# Altium project EDU_High-Speed-Design.PrjPcb (part 1 of 5)
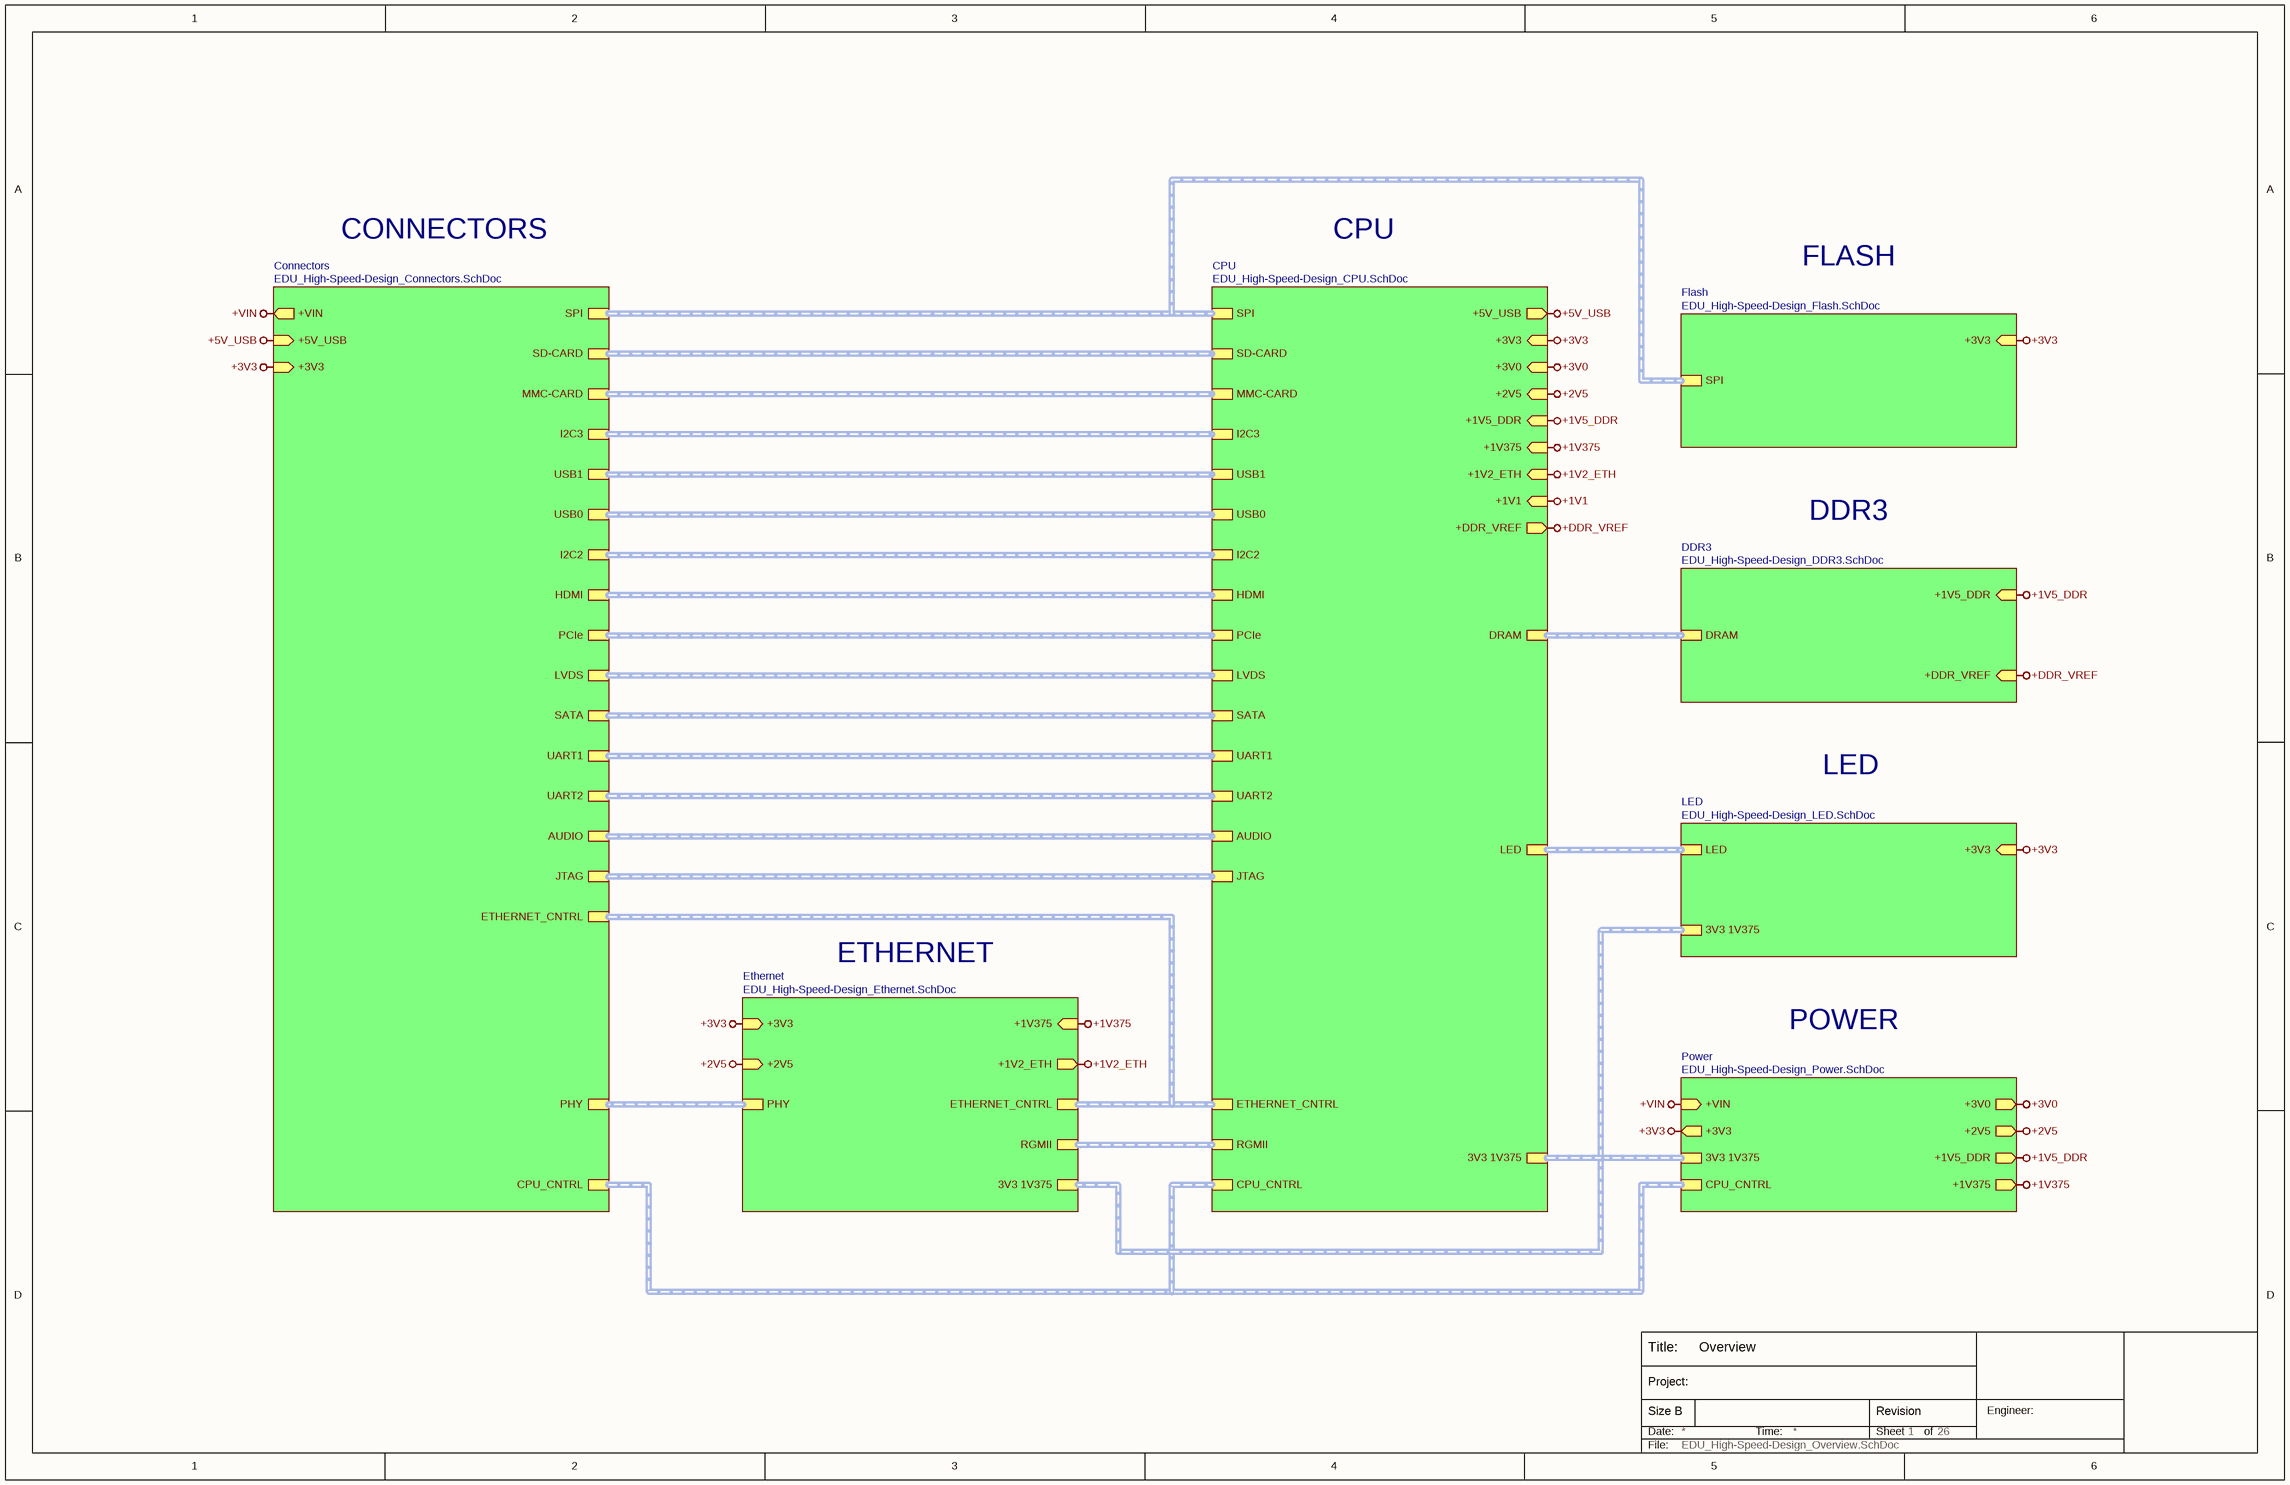
[diagram p0: EDU_High-Speed-Design_Overview.SchDoc]
GlobalAsmDwgTitle: Assembly Drawing; GlobalDocumentTitle: EDU High-Speed Design; GlobalEngineer: Podlesnyi Vasilii; GlobalPcbDwgTitle: PCB Drawing; GlobalProjectTitle: EDU High-Speed Design; GlobalRevisionBOM: 0.1; GlobalRevisionPCB: 0.1; GlobalRevisionSCH: 0.1
26 sheets, 457 parts. Net scope: hierarchical (ports join the sheet entries above them; power ports are global).
Board file: EDU_High-Speed-Design.PcbDoc
Sheets:
  EDU_High-Speed-Design_Overview.SchDoc
    CPU = EDU_High-Speed-Design_CPU.SchDoc
      CPU Unused = EDU_High-Speed-Design_CPU_Unused.SchDoc
      CPU Power = EDU_High-Speed-Design_CPU_Power.SchDoc
      CPU Control = EDU_High-Speed-Design_CPU_Control.SchDoc
      CPU Uart = EDU_High-Speed-Design_CPU_Uart.SchDoc
      CPU Audio = EDU_High-Speed-Design_CPU_Audio.SchDoc
      CPU Ethernet = EDU_High-Speed-Design_CPU_Ethernet.SchDoc
      CPU USB = EDU_High-Speed-Design_CPU_USB.SchDoc
      CPU LVDS = EDU_High-Speed-Design_CPU_LVDS.SchDoc
      CPU HDMI = EDU_High-Speed-Design_CPU_HDMI.SchDoc
      CPU PCIe = EDU_High-Speed-Design_CPU_PCIe.SchDoc
      CPU DDR3 = EDU_High-Speed-Design_CPU_DDR3.SchDoc
      CPU SD-Card = EDU_High-Speed-Design_CPU_SD-Card.SchDoc
      CPU MMC-Card = EDU_High-Speed-Design_CPU_MMC-Card.SchDoc
      CPU SPI I2C = EDU_High-Speed-Design_CPU_SPI_I2C.SchDoc
      CPU SATA = EDU_High-Speed-Design_CPU_SATA.SchDoc
    Connectors = EDU_High-Speed-Design_Connectors.SchDoc
    Ethernet = EDU_High-Speed-Design_Ethernet.SchDoc
    Flash = EDU_High-Speed-Design_Flash.SchDoc
    DDR3 = EDU_High-Speed-Design_DDR3.SchDoc
    Power = EDU_High-Speed-Design_Power.SchDoc
      3V3 1V375 = EDU_High-Speed-Design_Power_3V3_1V375.SchDoc
      3V0 = EDU_High-Speed-Design_Power_3V0.SchDoc
      2V5 1V5 = EDU_High-Speed-Design_Power_2V5_1V5.SchDoc
    LED = EDU_High-Speed-Design_LED.SchDoc

## Sheet EDU_High-Speed-Design_Overview.SchDoc: Overview
size 431 x 279 mm; Date: not used; ApprovedBy: not used; CheckedBy: not used; Author: not used; DrawnBy: not used; Engineer: Podlesnyi Vasilii; Organization: not used; Address4: not used; Revision: 0.1; SheetNumber: 1; SheetTotal: 26; ProjectTitle: EDU High-Speed Design; Time: not used; ImagePath: not used; Application_BuildNumber: not used

### Sub-sheets
Connectors = EDU_High-Speed-Design_Connectors.SchDoc: +VIN (out), +5V_USB (in), +3V3 (in), JTAG (harness JTAG), CPU_CNTRL (harness CPU_CNTRL), AUDIO (harness AUDIO), UART2 (harness UART2), UART1 (harness UART1), SATA (harness SATA), LVDS (harness LVDS), PCIe (harness PCIe), HDMI (harness HDMI), I2C2 (harness I2C2), USB0 (harness USB0), USB1 (harness USB1), SPI (harness SPI), I2C3 (harness I2C3), MMC-CARD (harness MMC-CARD), SD-CARD (harness SD-CARD), PHY (harness PHY), ETHERNET_CNTRL (harness ETHERNET_CNTRL)
CPU = EDU_High-Speed-Design_CPU.SchDoc: +3V3 (in), +3V0 (in), +2V5 (in), +1V375 (in), +1V2_ETH (in), RGMII (harness RGMII), JTAG (harness JTAG), CPU_CNTRL (harness CPU_CNTRL), UART1 (harness UART1), UART2 (harness UART2), AUDIO (harness AUDIO), ETHERNET_CNTRL (harness ETHERNET_CNTRL), USB1 (harness USB1), USB0 (harness USB0), LVDS (harness LVDS), I2C3 (harness I2C3), HDMI (harness HDMI), I2C2 (harness I2C2), SATA (harness SATA), PCIe (harness PCIe), DRAM (harness DRAM), MMC-CARD (harness MMC-CARD), SPI (harness SPI), +5V_USB (out), LED (harness LED), +1V1 (in), SD-CARD (harness SD-CARD), +1V5_DDR (in), +DDR_VREF (out), 3V3 1V375 (harness 3V3 1V375)
DDR3 = EDU_High-Speed-Design_DDR3.SchDoc: +1V5_DDR (in), DRAM (harness DRAM), +DDR_VREF (in)
Ethernet = EDU_High-Speed-Design_Ethernet.SchDoc: RGMII (harness RGMII), +3V3 (in), PHY (harness PHY), +2V5 (in), ETHERNET_CNTRL (harness ETHERNET_CNTRL), +1V2_ETH (out), +1V375 (in), 3V3 1V375 (harness 3V3 1V375)
Flash = EDU_High-Speed-Design_Flash.SchDoc: +3V3 (in), SPI (harness SPI)
LED = EDU_High-Speed-Design_LED.SchDoc: +3V3 (in), LED (harness LED), 3V3 1V375 (harness 3V3 1V375)
Power = EDU_High-Speed-Design_Power.SchDoc: +2V5 (out), +VIN (in), +3V3 (out), 3V3 1V375 (harness 3V3 1V375), +3V0 (out), +1V375 (out), +1V5_DDR (out), CPU_CNTRL (harness CPU_CNTRL)

### Nets
+1V2_ETH: sheet CPU/+1V2_ETH, sheet Ethernet/+1V2_ETH
+1V5_DDR: sheet CPU/+1V5_DDR, sheet DDR3/+1V5_DDR, sheet Power/+1V5_DDR
+1V375: sheet CPU/+1V375, sheet Ethernet/+1V375, sheet Power/+1V375
+2V5: sheet CPU/+2V5, sheet Ethernet/+2V5, sheet Power/+2V5
+3V0: sheet CPU/+3V0, sheet Power/+3V0
+3V3: sheet CPU/+3V3, sheet Connectors/+3V3, sheet Ethernet/+3V3, sheet Flash/+3V3, sheet Power/+3V3, sheet LED/+3V3
+5V_USB: sheet CPU/+5V_USB, sheet Connectors/+5V_USB
+DDR_VREF: sheet CPU/+DDR_VREF, sheet DDR3/+DDR_VREF
+VIN: sheet Connectors/+VIN, sheet Power/+VIN

### Buses and harness runs
harness sheet Connectors/AUDIO = sheet CPU/AUDIO
harness sheet Connectors/CPU_CNTRL = sheet CPU/CPU_CNTRL = sheet Power/CPU_CNTRL
harness sheet Connectors/ETHERNET_CNTRL = sheet CPU/ETHERNET_CNTRL = sheet Ethernet/ETHERNET_CNTRL
harness sheet Connectors/HDMI = sheet CPU/HDMI
harness sheet Connectors/I2C2 = sheet CPU/I2C2
harness sheet Connectors/I2C3 = sheet CPU/I2C3
harness sheet Connectors/JTAG = sheet CPU/JTAG
harness sheet Connectors/LVDS = sheet CPU/LVDS
harness sheet Connectors/MMC-CARD = sheet CPU/MMC-CARD
harness sheet Connectors/PCIe = sheet CPU/PCIe
harness sheet Connectors/PHY = sheet Ethernet/PHY
harness sheet Connectors/SATA = sheet CPU/SATA
harness sheet Connectors/SD-CARD = sheet CPU/SD-CARD
harness sheet Connectors/SPI = sheet CPU/SPI = sheet Flash/SPI
harness sheet Connectors/UART1 = sheet CPU/UART1
harness sheet Connectors/UART2 = sheet CPU/UART2
harness sheet Connectors/USB0 = sheet CPU/USB0
harness sheet Connectors/USB1 = sheet CPU/USB1
harness sheet CPU/3V3 1V375 = sheet Ethernet/3V3 1V375 = sheet LED/3V3 1V375 = sheet Power/3V3 1V375
harness sheet CPU/DRAM = sheet DDR3/DRAM
harness sheet CPU/LED = sheet LED/LED
harness sheet CPU/RGMII = sheet Ethernet/RGMII

### Notes on the sheet
- CONNECTORS
- CPU
- FLASH
- DDR3
- LED
- ETHERNET
- POWER
- Title:
- Date:
- Size B
- Project:
- Time:
- Sheet
- Revision
- of
- Engineer:
- File:

## Sheet EDU_High-Speed-Design_CPU.SchDoc: CPU
size 431 x 279 mm; Date: not used; ApprovedBy: not used; CheckedBy: not used; Author: not used; DrawnBy: not used; Engineer: Podlesnyi Vasilii; Organization: not used; Address4: not used; Revision: 0.1; SheetNumber: 11; SheetTotal: 26; ProjectTitle: EDU High-Speed Design; Time: not used; ImagePath: not used; Application_BuildNumber: not used
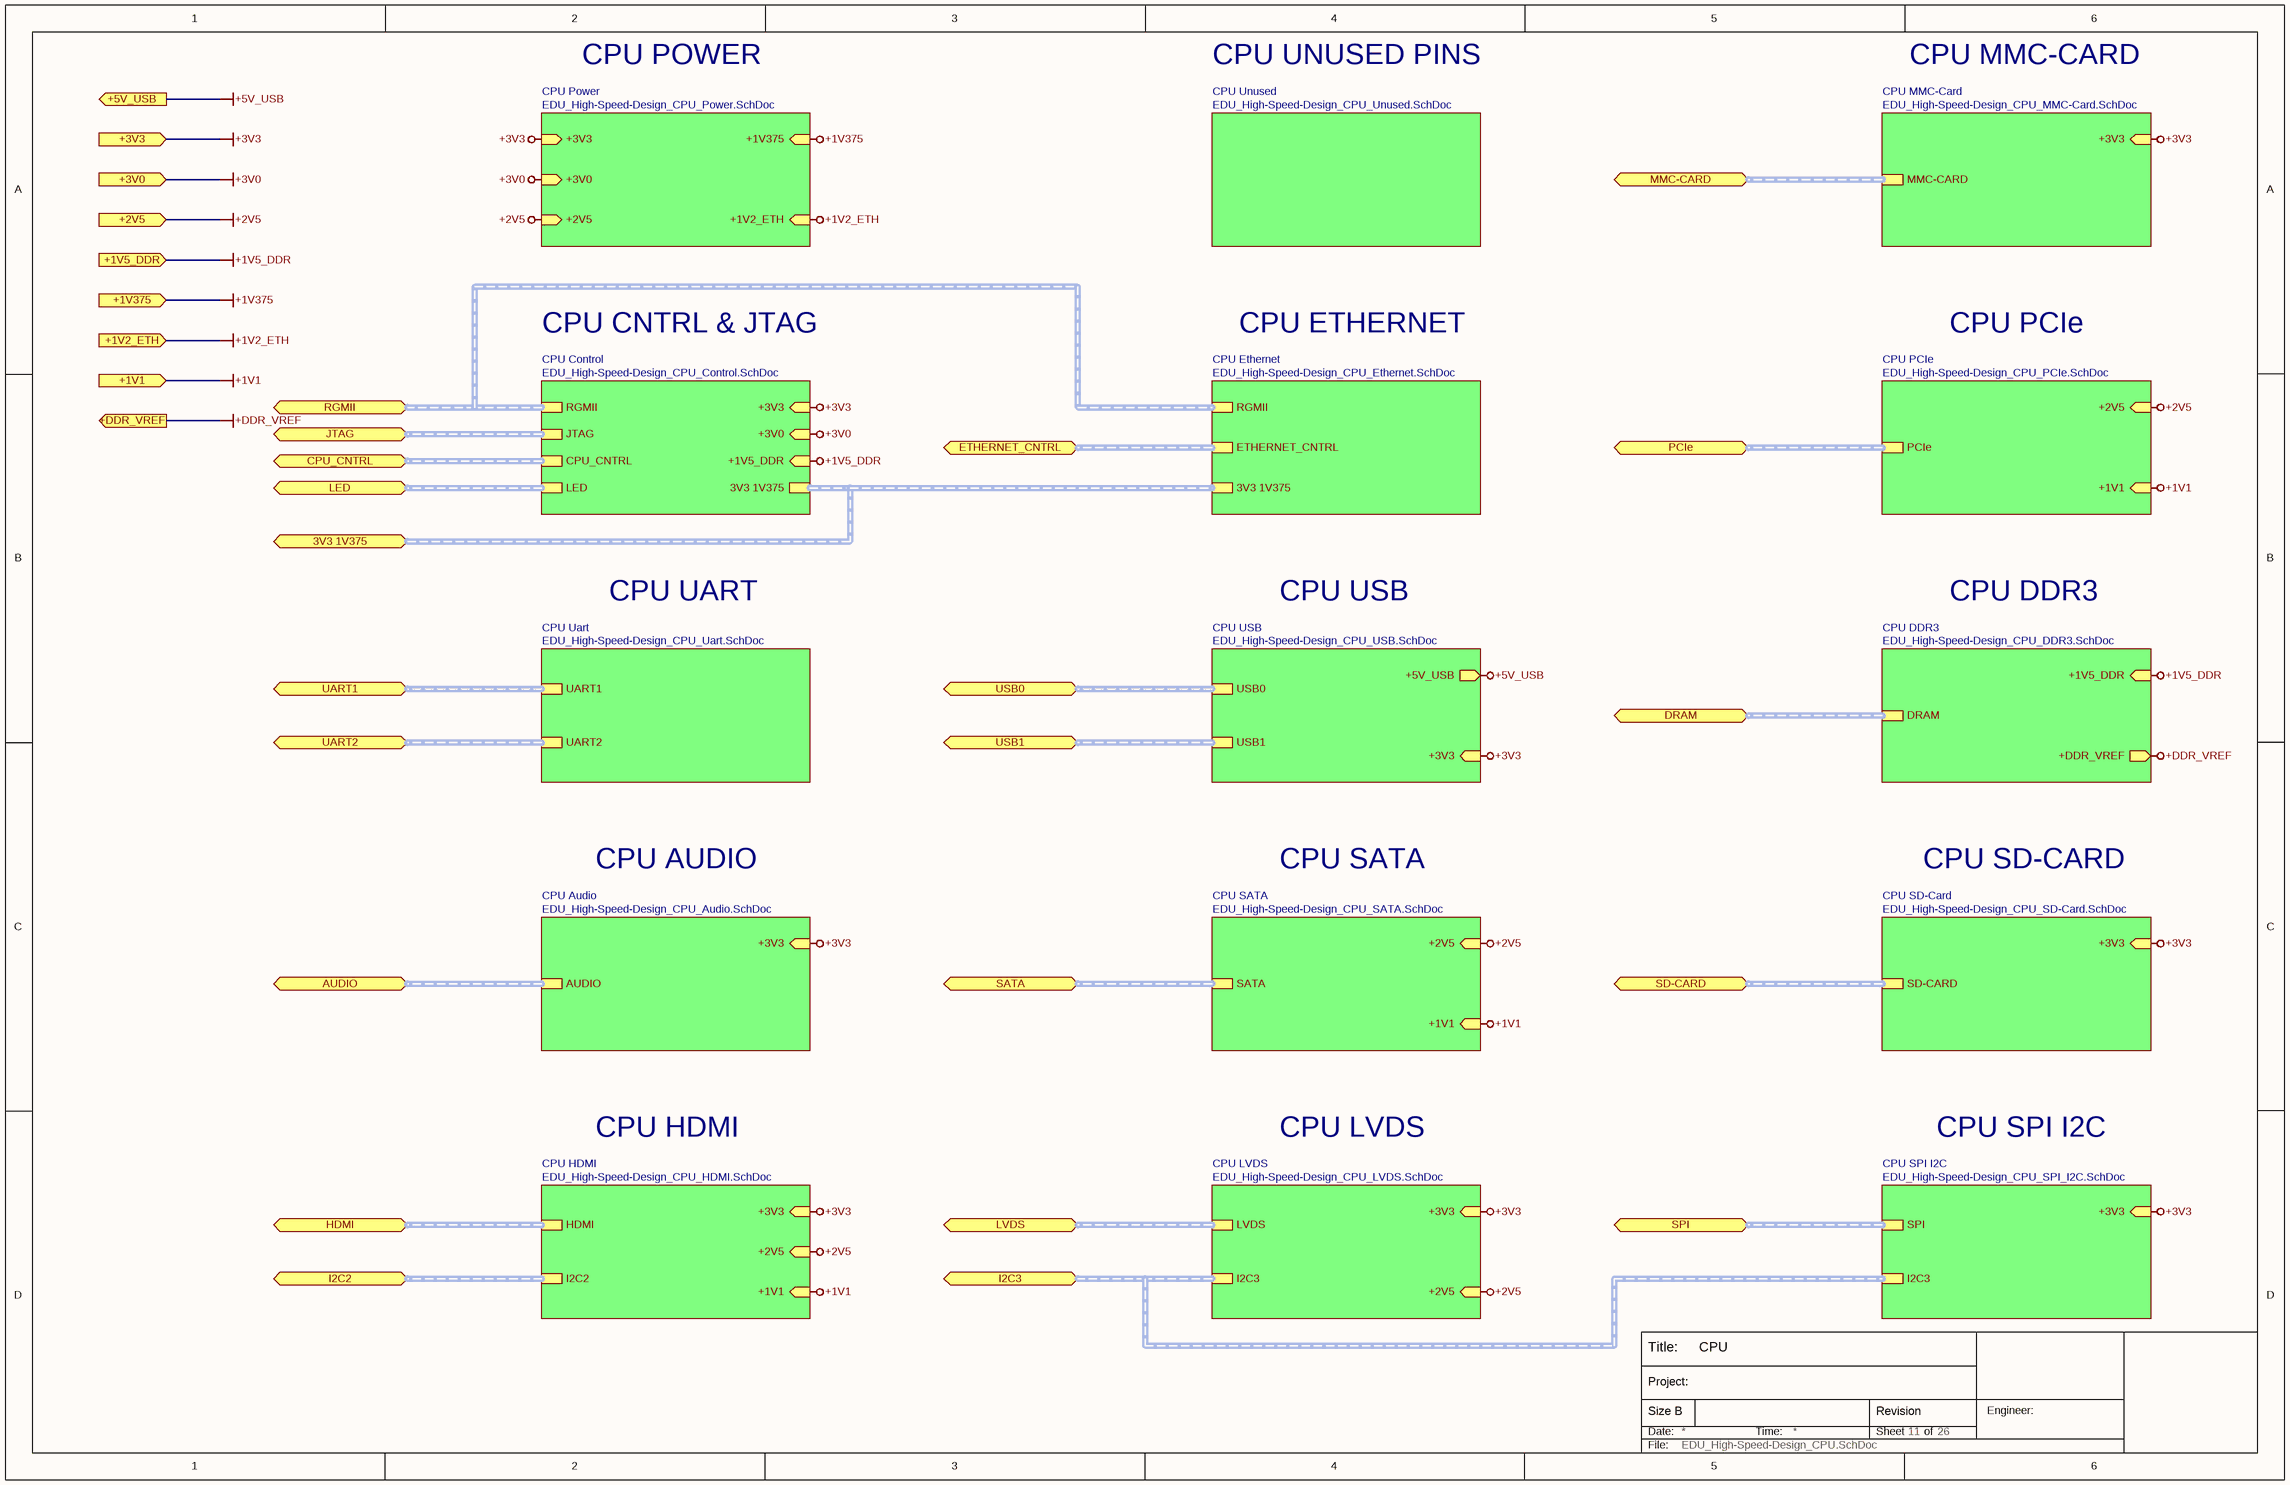
[diagram p1: EDU_High-Speed-Design_CPU.SchDoc]

### Sub-sheets
CPU Audio = EDU_High-Speed-Design_CPU_Audio.SchDoc: AUDIO (harness AUDIO), +3V3 (in)
CPU Control = EDU_High-Speed-Design_CPU_Control.SchDoc: RGMII (harness RGMII), JTAG (harness JTAG), CPU_CNTRL (harness CPU_CNTRL), LED (harness LED), +3V3 (in), +3V0 (in), +1V5_DDR (in), 3V3 1V375 (harness 3V3 1V375)
CPU DDR3 = EDU_High-Speed-Design_CPU_DDR3.SchDoc: DRAM (harness DRAM), +1V5_DDR (in), +DDR_VREF (out)
CPU Ethernet = EDU_High-Speed-Design_CPU_Ethernet.SchDoc: RGMII (harness RGMII), ETHERNET_CNTRL (harness ETHERNET_CNTRL), 3V3 1V375 (harness 3V3 1V375)
CPU HDMI = EDU_High-Speed-Design_CPU_HDMI.SchDoc: HDMI (harness HDMI), +3V3 (in), I2C2 (harness I2C2), +2V5 (in), +1V1 (in)
CPU LVDS = EDU_High-Speed-Design_CPU_LVDS.SchDoc: LVDS (harness LVDS), I2C3 (harness I2C3), +3V3 (in), +2V5 (in)
CPU MMC-Card = EDU_High-Speed-Design_CPU_MMC-Card.SchDoc: MMC-CARD (harness MMC-CARD), +3V3 (in)
CPU PCIe = EDU_High-Speed-Design_CPU_PCIe.SchDoc: PCIe (harness PCIe), +2V5 (in), +1V1 (in)
CPU Power = EDU_High-Speed-Design_CPU_Power.SchDoc: +3V3 (in), +3V0 (in), +2V5 (in), +1V375 (in), +1V2_ETH (in)
CPU SATA = EDU_High-Speed-Design_CPU_SATA.SchDoc: SATA (harness SATA), +2V5 (in), +1V1 (in)
CPU SD-Card = EDU_High-Speed-Design_CPU_SD-Card.SchDoc: SD-CARD (harness SD-CARD), +3V3 (in)
CPU SPI I2C = EDU_High-Speed-Design_CPU_SPI_I2C.SchDoc: SPI (harness SPI), I2C3 (harness I2C3), +3V3 (in)
CPU Uart = EDU_High-Speed-Design_CPU_Uart.SchDoc: UART1 (harness UART1), UART2 (harness UART2)
CPU Unused = EDU_High-Speed-Design_CPU_Unused.SchDoc: no entries
CPU USB = EDU_High-Speed-Design_CPU_USB.SchDoc: USB0 (harness USB0), USB1 (harness USB1), +5V_USB (out), +3V3 (in)

### Ports
3V3 1V375 (bidir, harness 3V3 1V375), +1V1 (in), +1V2_ETH (in), +1V5_DDR (in), +1V375 (in), +2V5 (in), +3V0 (in), +3V3 (in), +5V_USB (out), +DDR_VREF (out), AUDIO (bidir, harness AUDIO), CPU_CNTRL (bidir, harness CPU_CNTRL), DRAM (bidir, harness DRAM), ETHERNET_CNTRL (bidir, harness ETHERNET_CNTRL), HDMI (bidir, harness HDMI), I2C2 (bidir, harness I2C2), I2C3 (bidir, harness I2C3), JTAG (bidir, harness JTAG), LED (bidir, harness LED), LVDS (bidir, harness LVDS), MMC-CARD (bidir, harness MMC-CARD), PCIe (bidir, harness PCIe), RGMII (bidir, harness RGMII), SATA (bidir, harness SATA), SD-CARD (bidir, harness SD-CARD), SPI (bidir, harness SPI), UART1 (bidir, harness UART1), UART2 (bidir, harness UART2), USB0 (bidir, harness USB0), USB1 (bidir, harness USB1)

### Nets
+1V1: port +1V1, sheet CPU HDMI/+1V1, sheet CPU PCIe/+1V1, sheet CPU SATA/+1V1
+1V2_ETH: port +1V2_ETH, sheet CPU Power/+1V2_ETH
+1V5_DDR: port +1V5_DDR, sheet CPU Control/+1V5_DDR, sheet CPU DDR3/+1V5_DDR
+1V375: port +1V375, sheet CPU Power/+1V375
+2V5: port +2V5, sheet CPU Power/+2V5, sheet CPU LVDS/+2V5, sheet CPU HDMI/+2V5, sheet CPU PCIe/+2V5, sheet CPU SATA/+2V5
+3V0: port +3V0, sheet CPU Power/+3V0, sheet CPU Control/+3V0
+3V3: port +3V3, sheet CPU Power/+3V3, sheet CPU Control/+3V3, sheet CPU Audio/+3V3, sheet CPU USB/+3V3, sheet CPU LVDS/+3V3, sheet CPU HDMI/+3V3, sheet CPU SD-Card/+3V3, sheet CPU MMC-Card/+3V3, sheet CPU SPI I2C/+3V3
+5V_USB: port +5V_USB, sheet CPU USB/+5V_USB
+DDR_VREF: port +DDR_VREF, sheet CPU DDR3/+DDR_VREF

### Buses and harness runs
harness port 3V3 1V375 = sheet CPU Control/3V3 1V375 = sheet CPU Ethernet/3V3 1V375
harness port AUDIO = sheet CPU Audio/AUDIO
harness port CPU_CNTRL = sheet CPU Control/CPU_CNTRL
harness port DRAM = sheet CPU DDR3/DRAM
harness port ETHERNET_CNTRL = sheet CPU Ethernet/ETHERNET_CNTRL
harness port HDMI = sheet CPU HDMI/HDMI
harness port I2C2 = sheet CPU HDMI/I2C2
harness port I2C3 = sheet CPU LVDS/I2C3 = sheet CPU SPI I2C/I2C3
harness port JTAG = sheet CPU Control/JTAG
harness port LED = sheet CPU Control/LED
harness port LVDS = sheet CPU LVDS/LVDS
harness port MMC-CARD = sheet CPU MMC-Card/MMC-CARD
harness port PCIe = sheet CPU PCIe/PCIe
harness port RGMII = sheet CPU Control/RGMII = sheet CPU Ethernet/RGMII
harness port SATA = sheet CPU SATA/SATA
harness port SD-CARD = sheet CPU SD-Card/SD-CARD
harness port SPI = sheet CPU SPI I2C/SPI
harness port UART1 = sheet CPU Uart/UART1
harness port UART2 = sheet CPU Uart/UART2
harness port USB0 = sheet CPU USB/USB0
harness port USB1 = sheet CPU USB/USB1

### Notes on the sheet
- CPU POWER
- CPU UNUSED PINS
- CPU MMC-CARD
- CPU CNTRL & JTAG
- CPU ETHERNET
- CPU PCIe
- CPU UART
- CPU USB
- CPU DDR3
- CPU AUDIO
- CPU SATA
- CPU SD-CARD
- CPU HDMI
- CPU LVDS
- CPU SPI I2C
- Title:
- Date:
- Size B
- Project:
- Time:
- Sheet
- Revision
- of
- Engineer:
- File:

## Sheet EDU_High-Speed-Design_CPU_Unused.SchDoc: CPU Unused
size 431 x 279 mm; Date: not used; ApprovedBy: not used; CheckedBy: not used; Author: not used; DrawnBy: not used; Engineer: Podlesnyi Vasilii; Organization: not used; Address4: not used; Revision: 0.1; SheetNumber: 27; SheetTotal: 27; ProjectTitle: EDU High-Speed Design; Time: not used; ImagePath: not used; Application_BuildNumber: not used
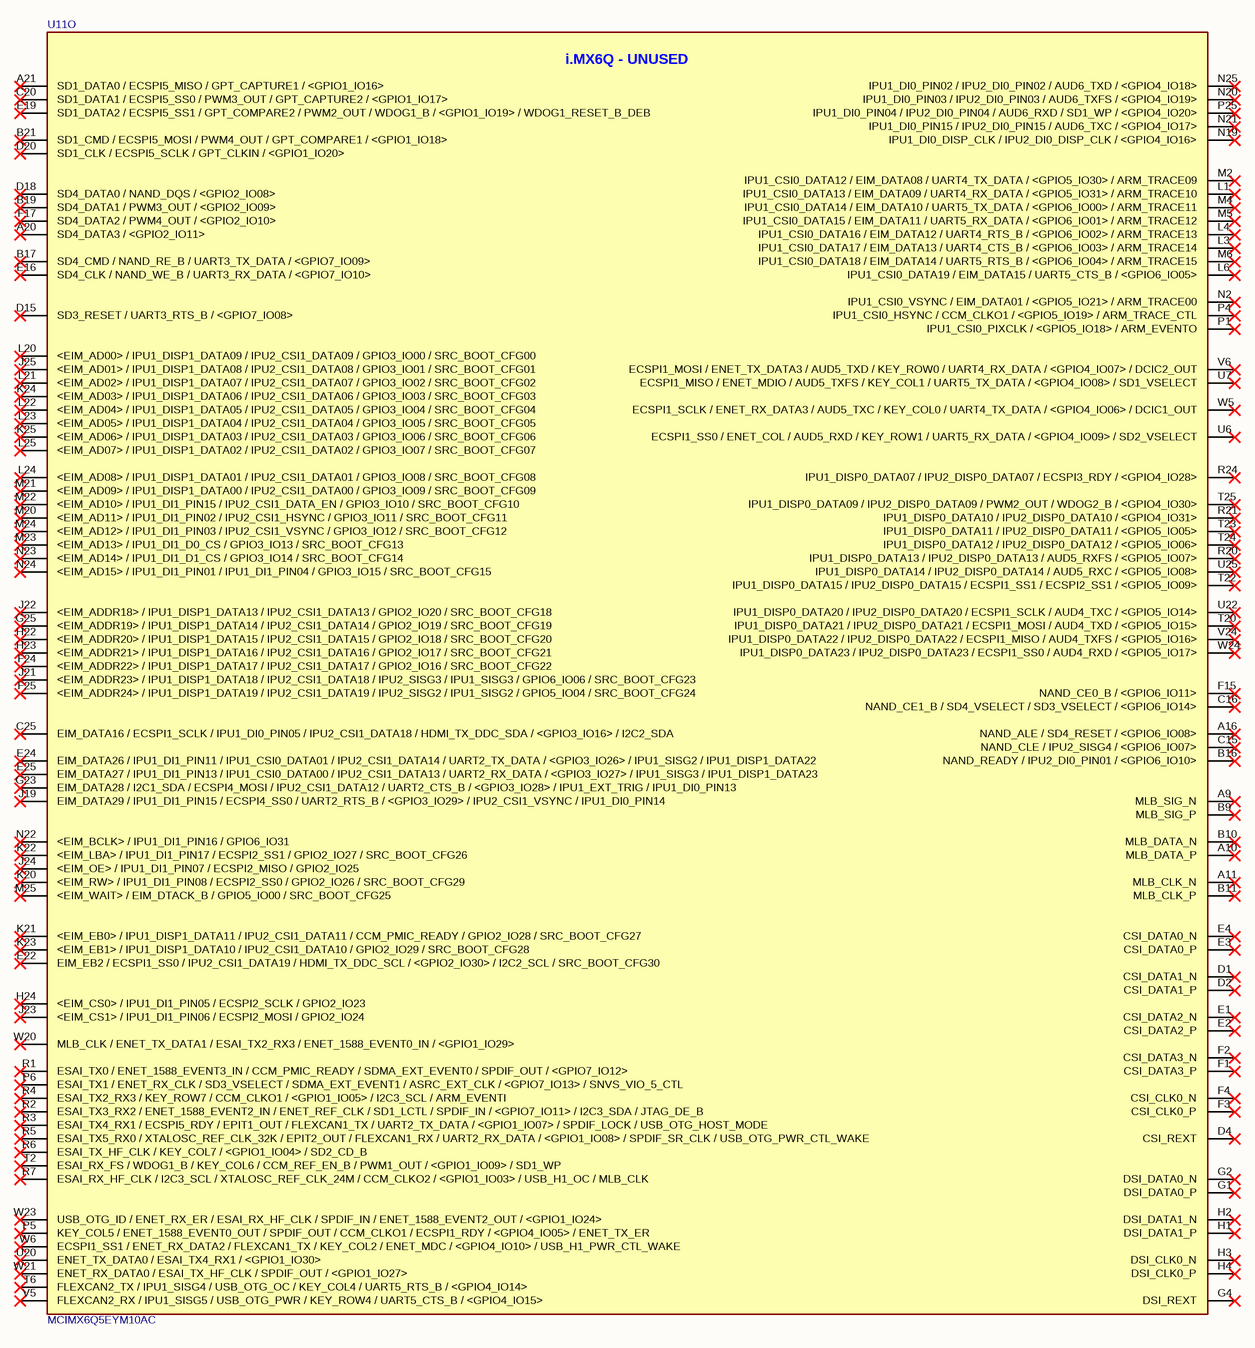
[diagram p2: EDU_High-Speed-Design_CPU_Unused.SchDoc]

### Parts
U11  MCIMX6Q5EYM10AC  [MCIMX6Q5EYM10AC]  (part O of 15)

### Nets

Not connected (* = marked no-connect by the designer): U11 A9(MLB_SIG_N)* A10(MLB_DATA_P)* A11(MLB_CLK_N)* A16(NAND_ALE_/_SD4_RESET_/_<GPIO6_IO08>)* A20(SD4_DATA3_/_<GPIO2_IO11>)* A21(SD1_DATA0_/_ECSPI5_MISO_/_GPT_CAPTURE1_/_<GPIO1_IO16>)* B9(MLB_SIG_P)* B10(MLB_DATA_N)* B11(MLB_CLK_P)* B16(NAND_READY_/_IPU2_DI0_PIN01_/_<GPIO6_IO10>)* B17(SD4_CMD_/_NAND_RE_B_/_UART3_TX_DATA_/_<GPIO7_IO09>)* B19(SD4_DATA1_/_PWM3_OUT_/_<GPIO2_IO09>)* B21(SD1_CMD_/_ECSPI5_MOSI_/_PWM4_OUT_/_GPT_COMPARE1_/_<GPIO1_IO18>)* C15(NAND_CLE_/_IPU2_SISG4_/_<GPIO6_IO07>)* C16(NAND_CE1_B_/_SD4_VSELECT_/_SD3_VSELECT_/_<GPIO6_IO14>)* C20(SD1_DATA1_/_ECSPI5_SS0_/_PWM3_OUT_/_GPT_CAPTURE2_/_<GPIO1_IO17>)* C25(EIM_DATA16_/_ECSPI1_SCLK_/_IPU1_DI0_PIN05_/_IPU2_CSI1_DATA18_/_HDMI_TX_DDC_SDA_/_<GPIO3_IO16>_/_I2C2_SDA)* D1(CSI_DATA1_N)* D2(CSI_DATA1_P)* D4(CSI_REXT)* D15(SD3_RESET_/_UART3_RTS_B_/_<GPIO7_IO08>)* D18(SD4_DATA0_/_NAND_DQS_/_<GPIO2_IO08>)* D20(SD1_CLK_/_ECSPI5_SCLK_/_GPT_CLKIN_/_<GPIO1_IO20>)* E1(CSI_DATA2_N)* E2(CSI_DATA2_P)* E3(CSI_DATA0_P)* E4(CSI_DATA0_N)* E16(SD4_CLK_/_NAND_WE_B_/_UART3_RX_DATA_/_<GPIO7_IO10>)* E19(SD1_DATA2_/_ECSPI5_SS1_/_GPT_COMPARE2_/_PWM2_OUT_/_WDOG1_B_/_<GPIO1_IO19>_/_WDOG1_RESET_B_DEB)* E22(EIM_EB2_/_ECSPI1_SS0_/_IPU2_CSI1_DATA19_/_HDMI_TX_DDC_SCL_/_<GPIO2_IO30>_/_I2C2_SCL_/_SRC_BOOT_CFG30)* E24(EIM_DATA26_/_IPU1_DI1_PIN11_/_IPU1_CSI0_DATA01_/_IPU2_CSI1_DATA14_/_UART2_TX_DATA_/_<GPIO3_IO26>_/_IPU1_SISG2_/_IPU1_DISP1_DATA22)* E25(EIM_DATA27_/_IPU1_DI1_PIN13_/_IPU1_CSI0_DATA00_/_IPU2_CSI1_DATA13_/_UART2_RX_DATA_/_<GPIO3_IO27>_/_IPU1_SISG3_/_IPU1_DISP1_DATA23)* F1(CSI_DATA3_P)* F2(CSI_DATA3_N)* F3(CSI_CLK0_P)* F4(CSI_CLK0_N)* F15(NAND_CE0_B_/_<GPIO6_IO11>)* F17(SD4_DATA2_/_PWM4_OUT_/_<GPIO2_IO10>)* F24(<EIM_ADDR22>_/_IPU1_DISP1_DATA17_/_IPU2_CSI1_DATA17_/_GPIO2_IO16_/_SRC_BOOT_CFG22)* F25(<EIM_ADDR24>_/_IPU1_DISP1_DATA19_/_IPU2_CSI1_DATA19_/_IPU2_SISG2_/_IPU1_SISG2_/_GPIO5_IO04_/_SRC_BOOT_CFG24)* G1(DSI_DATA0_P)* G2(DSI_DATA0_N)* G4(DSI_REXT)* G23(EIM_DATA28_/_I2C1_SDA_/_ECSPI4_MOSI_/_IPU2_CSI1_DATA12_/_UART2_CTS_B_/_<GPIO3_IO28>_/_IPU1_EXT_TRIG_/_IPU1_DI0_PIN13)* G25(<EIM_ADDR19>_/_IPU1_DISP1_DATA14_/_IPU2_CSI1_DATA14_/_GPIO2_IO19_/_SRC_BOOT_CFG19)* H1(DSI_DATA1_P)* H2(DSI_DATA1_N)* H3(DSI_CLK0_N)* H4(DSI_CLK0_P)* H22(<EIM_ADDR20>_/_IPU1_DISP1_DATA15_/_IPU2_CSI1_DATA15_/_GPIO2_IO18_/_SRC_BOOT_CFG20)* H23(<EIM_ADDR21>_/_IPU1_DISP1_DATA16_/_IPU2_CSI1_DATA16_/_GPIO2_IO17_/_SRC_BOOT_CFG21)* H24(<EIM_CS0>_/_IPU1_DI1_PIN05_/_ECSPI2_SCLK_/_GPIO2_IO23)* J19(EIM_DATA29_/_IPU1_DI1_PIN15_/_ECSPI4_SS0_/_UART2_RTS_B_/_<GPIO3_IO29>_/_IPU2_CSI1_VSYNC_/_IPU1_DI0_PIN14)* J21(<EIM_ADDR23>_/_IPU1_DISP1_DATA18_/_IPU2_CSI1_DATA18_/_IPU2_SISG3_/_IPU1_SISG3_/_GPIO6_IO06_/_SRC_BOOT_CFG23)* J22(<EIM_ADDR18>_/_IPU1_DISP1_DATA13_/_IPU2_CSI1_DATA13_/_GPIO2_IO20_/_SRC_BOOT_CFG18)* J23(<EIM_CS1>_/_IPU1_DI1_PIN06_/_ECSPI2_MOSI_/_GPIO2_IO24)* J24(<EIM_OE>_/_IPU1_DI1_PIN07_/_ECSPI2_MISO_/_GPIO2_IO25)* J25(<EIM_AD01>_/_IPU1_DISP1_DATA08_/_IPU2_CSI1_DATA08_/_GPIO3_IO01_/_SRC_BOOT_CFG01)* K20(<EIM_RW>_/_IPU1_DI1_PIN08_/_ECSPI2_SS0_/_GPIO2_IO26_/_SRC_BOOT_CFG29)* K21(<EIM_EB0>_/_IPU1_DISP1_DATA11_/_IPU2_CSI1_DATA11_/_CCM_PMIC_READY_/_GPIO2_IO28_/_SRC_BOOT_CFG27)* K22(<EIM_LBA>_/_IPU1_DI1_PIN17_/_ECSPI2_SS1_/_GPIO2_IO27_/_SRC_BOOT_CFG26)* K23(<EIM_EB1>_/_IPU1_DISP1_DATA10_/_IPU2_CSI1_DATA10_/_GPIO2_IO29_/_SRC_BOOT_CFG28)* K24(<EIM_AD03>_/_IPU1_DISP1_DATA06_/_IPU2_CSI1_DATA06_/_GPIO3_IO03_/_SRC_BOOT_CFG03)* K25(<EIM_AD06>_/_IPU1_DISP1_DATA03_/_IPU2_CSI1_DATA03_/_GPIO3_IO06_/_SRC_BOOT_CFG06)* L1(IPU1_CSI0_DATA13_/_EIM_DATA09_/_UART4_RX_DATA_/_<GPIO5_IO31>_/_ARM_TRACE10)* L3(IPU1_CSI0_DATA17_/_EIM_DATA13_/_UART4_CTS_B_/_<GPIO6_IO03>_/_ARM_TRACE14)* L4(IPU1_CSI0_DATA16_/_EIM_DATA12_/_UART4_RTS_B_/_<GPIO6_IO02>_/_ARM_TRACE13)* L6(IPU1_CSI0_DATA19_/_EIM_DATA15_/_UART5_CTS_B_/_<GPIO6_IO05>)* L20(<EIM_AD00>_/_IPU1_DISP1_DATA09_/_IPU2_CSI1_DATA09_/_GPIO3_IO00_/_SRC_BOOT_CFG00)* L21(<EIM_AD02>_/_IPU1_DISP1_DATA07_/_IPU2_CSI1_DATA07_/_GPIO3_IO02_/_SRC_BOOT_CFG02)* L22(<EIM_AD04>_/_IPU1_DISP1_DATA05_/_IPU2_CSI1_DATA05_/_GPIO3_IO04_/_SRC_BOOT_CFG04)* L23(<EIM_AD05>_/_IPU1_DISP1_DATA04_/_IPU2_CSI1_DATA04_/_GPIO3_IO05_/_SRC_BOOT_CFG05)* L24(<EIM_AD08>_/_IPU1_DISP1_DATA01_/_IPU2_CSI1_DATA01_/_GPIO3_IO08_/_SRC_BOOT_CFG08)* L25(<EIM_AD07>_/_IPU1_DISP1_DATA02_/_IPU2_CSI1_DATA02_/_GPIO3_IO07_/_SRC_BOOT_CFG07)* M2(IPU1_CSI0_DATA12_/_EIM_DATA08_/_UART4_TX_DATA_/_<GPIO5_IO30>_/_ARM_TRACE09)* M4(IPU1_CSI0_DATA14_/_EIM_DATA10_/_UART5_TX_DATA_/_<GPIO6_IO00>_/_ARM_TRACE11)* M5(IPU1_CSI0_DATA15_/_EIM_DATA11_/_UART5_RX_DATA_/_<GPIO6_IO01>_/_ARM_TRACE12)* M6(IPU1_CSI0_DATA18_/_EIM_DATA14_/_UART5_RTS_B_/_<GPIO6_IO04>_/_ARM_TRACE15)* M20(<EIM_AD11>_/_IPU1_DI1_PIN02_/_IPU2_CSI1_HSYNC_/_GPIO3_IO11_/_SRC_BOOT_CFG11)* M21(<EIM_AD09>_/_IPU1_DISP1_DATA00_/_IPU2_CSI1_DATA00_/_GPIO3_IO09_/_SRC_BOOT_CFG09)* M22(<EIM_AD10>_/_IPU1_DI1_PIN15_/_IPU2_CSI1_DATA_EN_/_GPIO3_IO10_/_SRC_BOOT_CFG10)* M23(<EIM_AD13>_/_IPU1_DI1_D0_CS_/_GPIO3_IO13_/_SRC_BOOT_CFG13)* M24(<EIM_AD12>_/_IPU1_DI1_PIN03_/_IPU2_CSI1_VSYNC_/_GPIO3_IO12_/_SRC_BOOT_CFG12)* M25(<EIM_WAIT>_/_EIM_DTACK_B_/_GPIO5_IO00_/_SRC_BOOT_CFG25)* N2(IPU1_CSI0_VSYNC_/_EIM_DATA01_/_<GPIO5_IO21>_/_ARM_TRACE00)* N19(IPU1_DI0_DISP_CLK_/_IPU2_DI0_DISP_CLK_/_<GPIO4_IO16>)* N20(IPU1_DI0_PIN03_/_IPU2_DI0_PIN03_/_AUD6_TXFS_/_<GPIO4_IO19>)* N21(IPU1_DI0_PIN15_/_IPU2_DI0_PIN15_/_AUD6_TXC_/_<GPIO4_IO17>)* N22(<EIM_BCLK>_/_IPU1_DI1_PIN16_/_GPIO6_IO31)* N23(<EIM_AD14>_/_IPU1_DI1_D1_CS_/_GPIO3_IO14_/_SRC_BOOT_CFG14)* N24(<EIM_AD15>_/_IPU1_DI1_PIN01_/_IPU1_DI1_PIN04_/_GPIO3_IO15_/_SRC_BOOT_CFG15)* N25(IPU1_DI0_PIN02_/_IPU2_DI0_PIN02_/_AUD6_TXD_/_<GPIO4_IO18>)* P1(IPU1_CSI0_PIXCLK_/_<GPIO5_IO18>_/_ARM_EVENTO)* P4(IPU1_CSI0_HSYNC_/_CCM_CLKO1_/_<GPIO5_IO19>_/_ARM_TRACE_CTL)* P5(KEY_COL5_/_ENET_1588_EVENT0_OUT_/_SPDIF_OUT_/_CCM_CLKO1_/_ECSPI1_RDY_/_<GPIO4_IO05>_/_ENET_TX_ER)* P6(ESAI_TX1_/_ENET_RX_CLK_/_SD3_VSELECT_/_SDMA_EXT_EVENT1_/_ASRC_EXT_CLK_/_<GPIO7_IO13>_/_SNVS_VIO_5_CTL)* P25(IPU1_DI0_PIN04_/_IPU2_DI0_PIN04_/_AUD6_RXD_/_SD1_WP_/_<GPIO4_IO20>)* R1(ESAI_TX0_/_ENET_1588_EVENT3_IN_/_CCM_PMIC_READY_/_SDMA_EXT_EVENT0_/_SPDIF_OUT_/_<GPIO7_IO12>)* R2(ESAI_TX3_RX2_/_ENET_1588_EVENT2_IN_/_ENET_REF_CLK_/_SD1_LCTL_/_SPDIF_IN_/_<GPIO7_IO11>_/_I2C3_SDA_/_JTAG_DE_B)* R3(ESAI_TX4_RX1_/_ECSPI5_RDY_/_EPIT1_OUT_/_FLEXCAN1_TX_/_UART2_TX_DATA_/_<GPIO1_IO07>_/_SPDIF_LOCK_/_USB_OTG_HOST_MODE)* R4(ESAI_TX2_RX3_/_KEY_ROW7_/_CCM_CLKO1_/_<GPIO1_IO05>_/_I2C3_SCL_/_ARM_EVENTI)* R5(ESAI_TX5_RX0_/_XTALOSC_REF_CLK_32K_/_EPIT2_OUT_/_FLEXCAN1_RX_/_UART2_RX_DATA_/_<GPIO1_IO08>_/_SPDIF_SR_CLK_/_USB_OTG_PWR_CTL_WAKE)* R6(ESAI_TX_HF_CLK_/_KEY_COL7_/_<GPIO1_IO04>_/_SD2_CD_B)* R7(ESAI_RX_HF_CLK_/_I2C3_SCL_/_XTALOSC_REF_CLK_24M_/_CCM_CLKO2_/_<GPIO1_IO03>_/_USB_H1_OC_/_MLB_CLK)* R20(IPU1_DISP0_DATA13_/_IPU2_DISP0_DATA13_/_AUD5_RXFS_/_<GPIO5_IO07>)* R21(IPU1_DISP0_DATA10_/_IPU2_DISP0_DATA10_/_<GPIO4_IO31>)* R24(IPU1_DISP0_DATA07_/_IPU2_DISP0_DATA07_/_ECSPI3_RDY_/_<GPIO4_IO28>)* T2(ESAI_RX_FS_/_WDOG1_B_/_KEY_COL6_/_CCM_REF_EN_B_/_PWM1_OUT_/_<GPIO1_IO09>_/_SD1_WP)* T6(FLEXCAN2_TX_/_IPU1_SISG4_/_USB_OTG_OC_/_KEY_COL4_/_UART5_RTS_B_/_<GPIO4_IO14>)* T20(IPU1_DISP0_DATA21_/_IPU2_DISP0_DATA21_/_ECSPI1_MOSI_/_AUD4_TXD_/_<GPIO5_IO15>)* T22(IPU1_DISP0_DATA15_/_IPU2_DISP0_DATA15_/_ECSPI1_SS1_/_ECSPI2_SS1_/_<GPIO5_IO09>)* T23(IPU1_DISP0_DATA11_/_IPU2_DISP0_DATA11_/_<GPIO5_IO05>)* T24(IPU1_DISP0_DATA12_/_IPU2_DISP0_DATA12_/_<GPIO5_IO06>)* T25(IPU1_DISP0_DATA09_/_IPU2_DISP0_DATA09_/_PWM2_OUT_/_WDOG2_B_/_<GPIO4_IO30>)* U6(ECSPI1_SS0_/_ENET_COL_/_AUD5_RXD_/_KEY_ROW1_/_UART5_RX_DATA_/_<GPIO4_IO09>_/_SD2_VSELECT)* U7(ECSPI1_MISO_/_ENET_MDIO_/_AUD5_TXFS_/_KEY_COL1_/_UART5_TX_DATA_/_<GPIO4_IO08>_/_SD1_VSELECT)* U20(ENET_TX_DATA0_/_ESAI_TX4_RX1_/_<GPIO1_IO30>)* U22(IPU1_DISP0_DATA20_/_IPU2_DISP0_DATA20_/_ECSPI1_SCLK_/_AUD4_TXC_/_<GPIO5_IO14>)* U25(IPU1_DISP0_DATA14_/_IPU2_DISP0_DATA14_/_AUD5_RXC_/_<GPIO5_IO08>)* V5(FLEXCAN2_RX_/_IPU1_SISG5_/_USB_OTG_PWR_/_KEY_ROW4_/_UART5_CTS_B_/_<GPIO4_IO15>)* V6(ECSPI1_MOSI_/_ENET_TX_DATA3_/_AUD5_TXD_/_KEY_ROW0_/_UART4_RX_DATA_/_<GPIO4_IO07>_/_DCIC2_OUT)* V24(IPU1_DISP0_DATA22_/_IPU2_DISP0_DATA22_/_ECSPI1_MISO_/_AUD4_TXFS_/_<GPIO5_IO16>)* W5(ECSPI1_SCLK_/_ENET_RX_DATA3_/_AUD5_TXC_/_KEY_COL0_/_UART4_TX_DATA_/_<GPIO4_IO06>_/_DCIC1_OUT)* W6(ECSPI1_SS1_/_ENET_RX_DATA2_/_FLEXCAN1_TX_/_KEY_COL2_/_ENET_MDC_/_<GPIO4_IO10>_/_USB_H1_PWR_CTL_WAKE)* W20(MLB_CLK_/_ENET_TX_DATA1_/_ESAI_TX2_RX3_/_ENET_1588_EVENT0_IN_/_<GPIO1_IO29>)* W21(ENET_RX_DATA0_/_ESAI_TX_HF_CLK_/_SPDIF_OUT_/_<GPIO1_IO27>)* W23(USB_OTG_ID_/_ENET_RX_ER_/_ESAI_RX_HF_CLK_/_SPDIF_IN_/_ENET_1588_EVENT2_OUT_/_<GPIO1_IO24>)* W24(IPU1_DISP0_DATA23_/_IPU2_DISP0_DATA23_/_ECSPI1_SS0_/_AUD4_RXD_/_<GPIO5_IO17>)*

### Notes on the sheet
- Title:
- Date:
- Size B
- Project:
- Time:
- Sheet
- Revision
- of
- Engineer:
- File:
- (in symbol MCIMX6Q5EYM10AC, part O) i.MX6Q - UNUSED

### Library data of the parts
U11 = MCIMX6Q5EYM10AC: IC MCU 32BIT ARM QUAD 624FCBGA; Manufacturer 1: Freescale Semiconductor; Supplier 1: Digi-Key; Manufacturer Part Number 1: MCIMX6Q5EYM10AC; Supplier Part Number 1: MCIMX6Q5EYM10AC-ND

## Sheet EDU_High-Speed-Design_CPU_Power.SchDoc: CPU Power
size 558 x 431 mm; Date: not used; ApprovedBy: not used; CheckedBy: not used; Author: not used; DrawnBy: not used; Engineer: Podlesnyi Vasilii; Organization: not used; Address4: not used; Revision: 0.1; SheetNumber: 12; SheetTotal: 26; ProjectTitle: EDU High-Speed Design; Time: not used; ImagePath: not used; Application_BuildNumber: not used
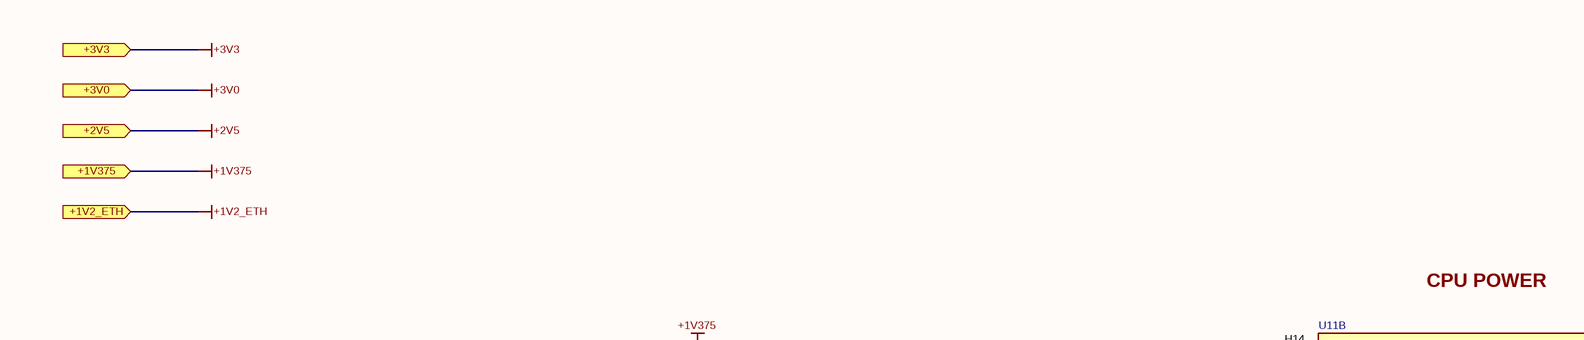
[diagram p3: EDU_High-Speed-Design_CPU_Power.SchDoc, top left]
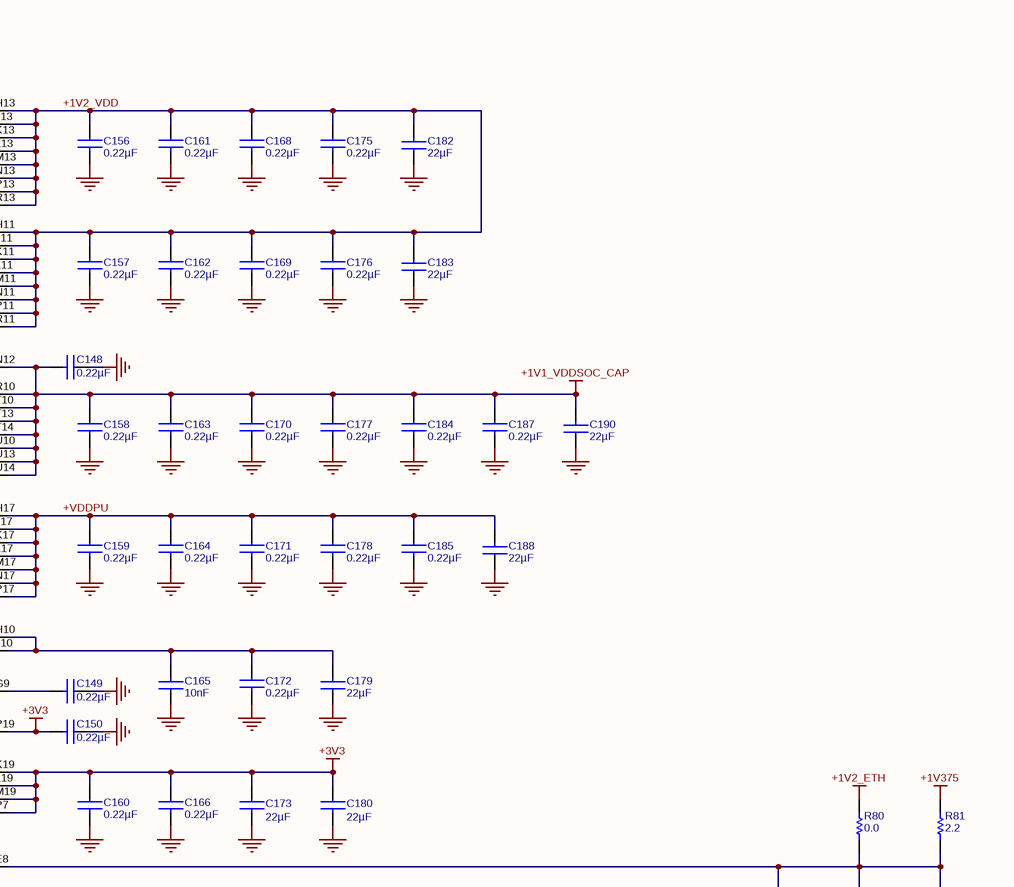
[diagram p4: EDU_High-Speed-Design_CPU_Power.SchDoc, top right]
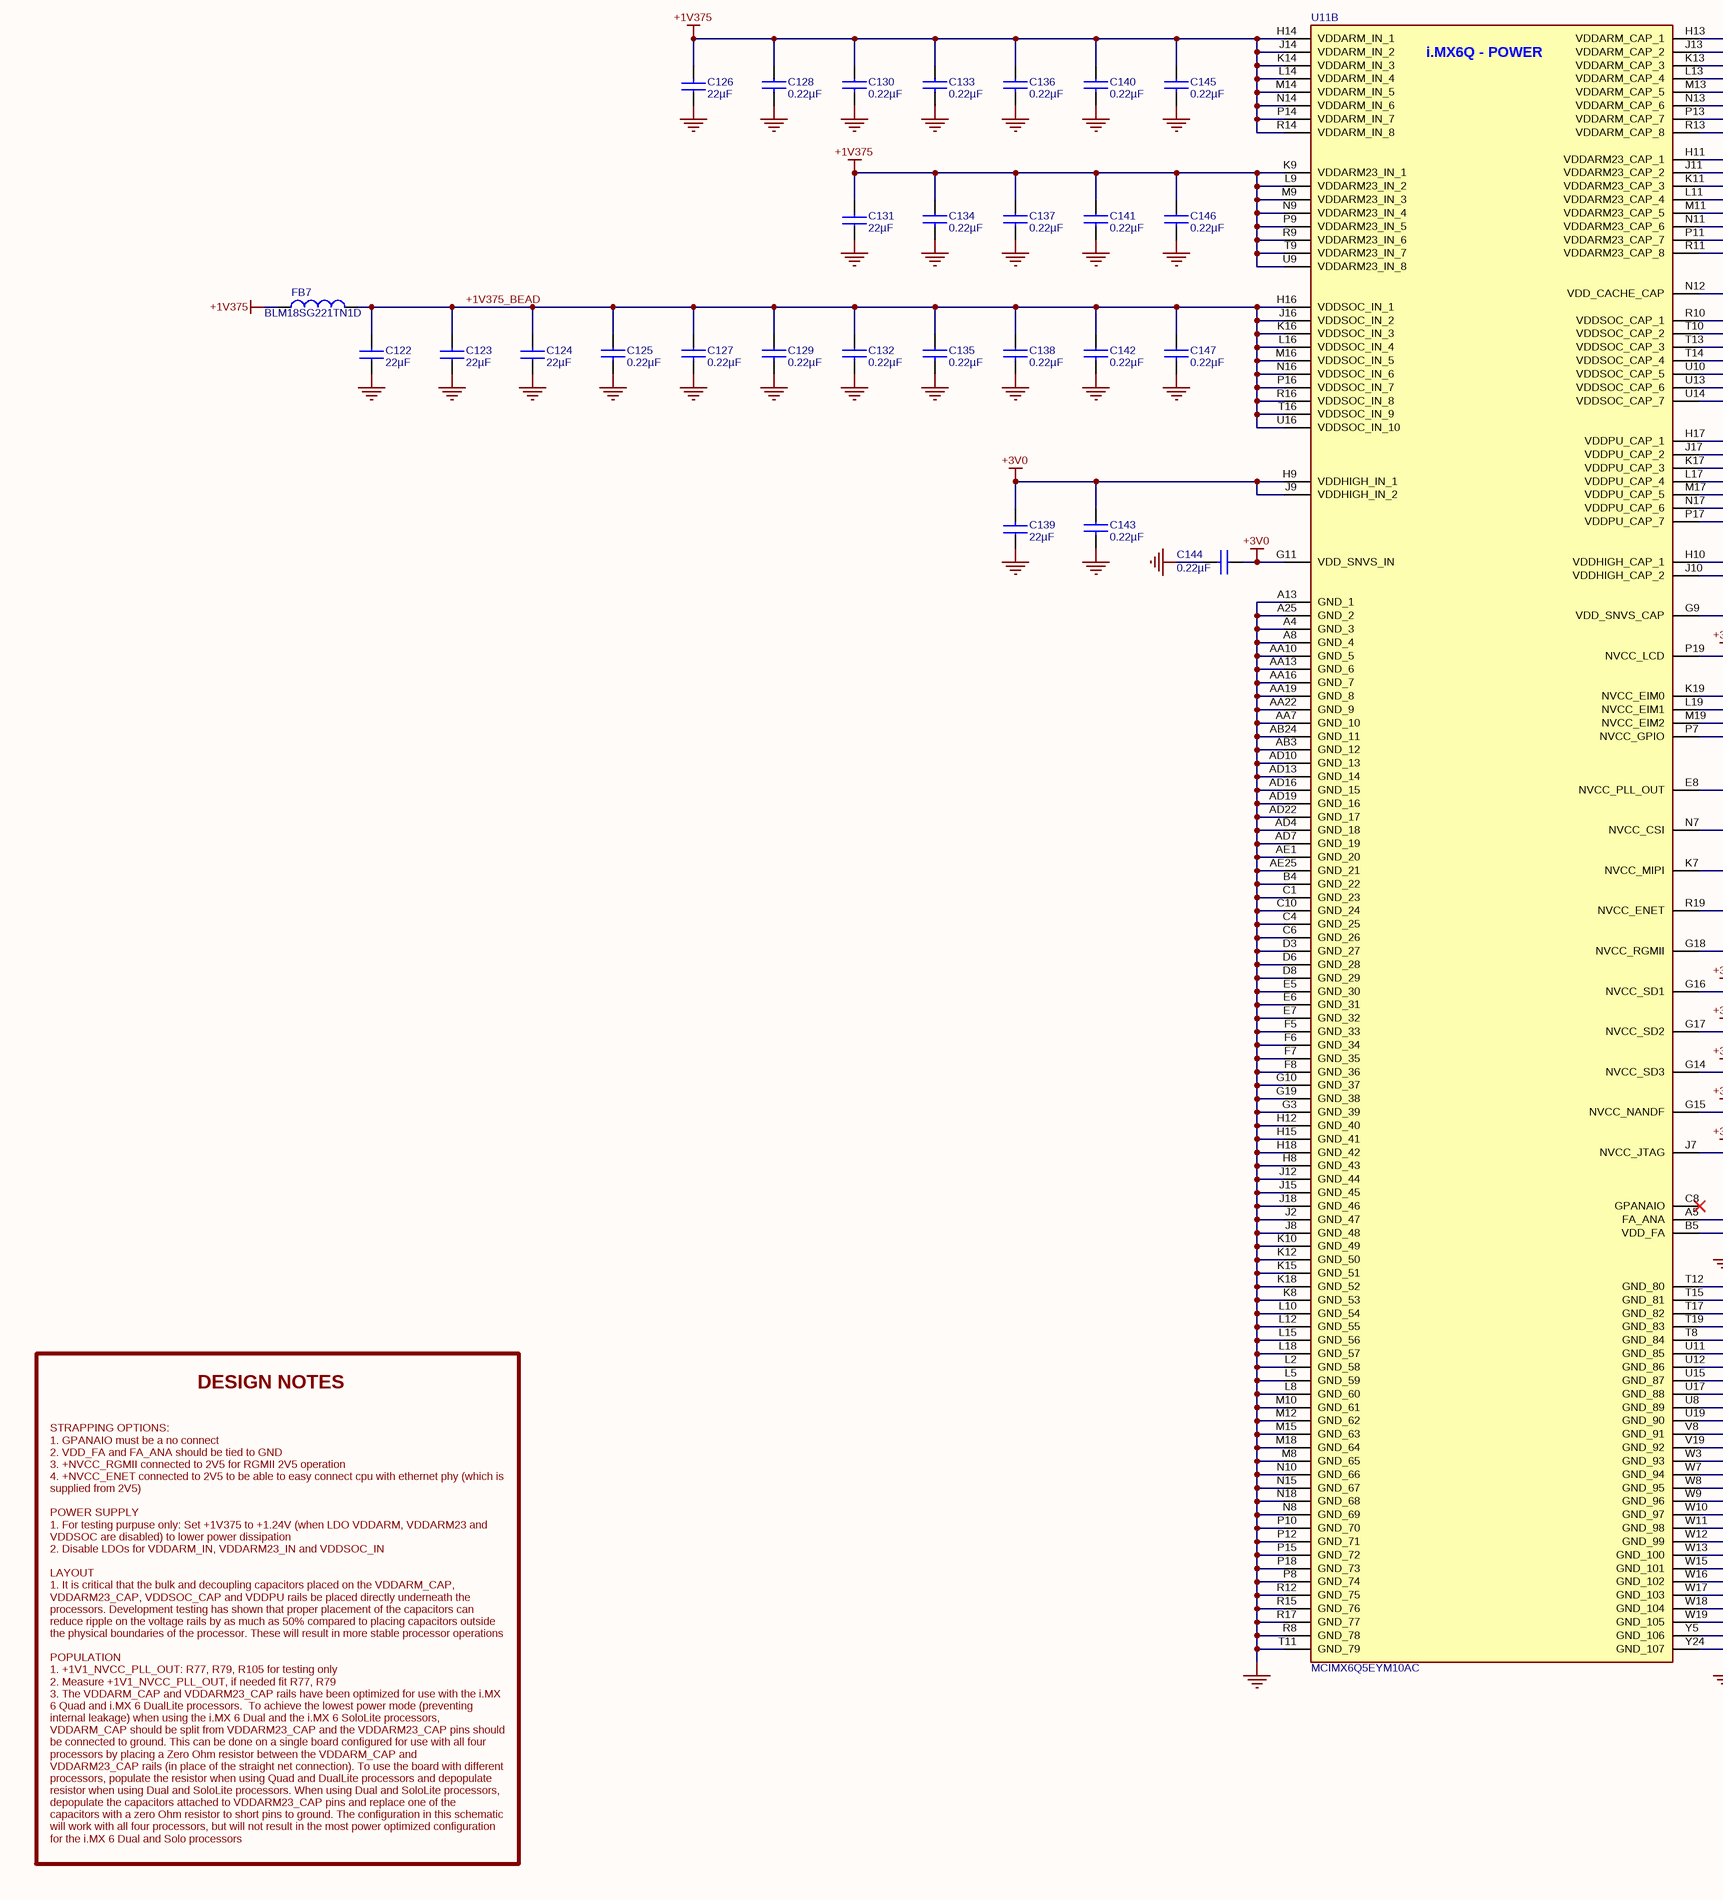
[diagram p5: EDU_High-Speed-Design_CPU_Power.SchDoc, bottom left]
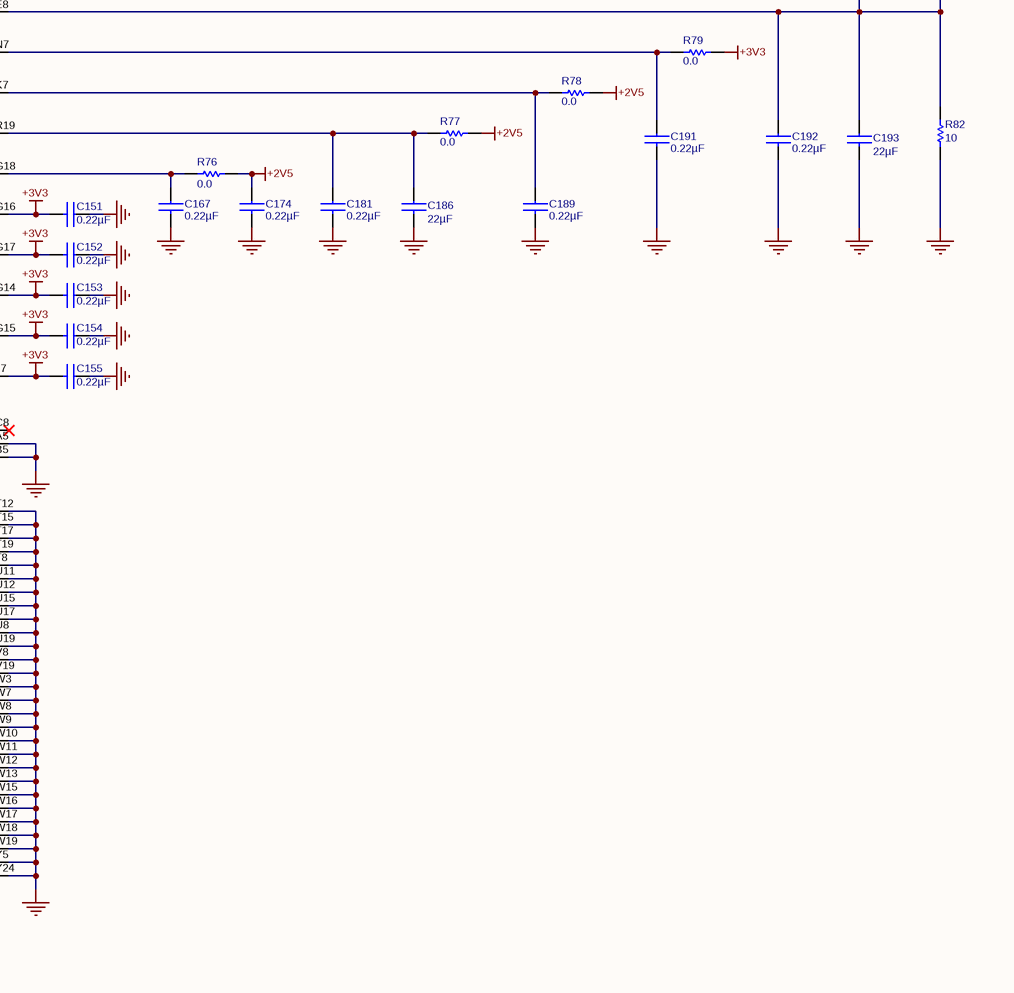
[diagram p6: EDU_High-Speed-Design_CPU_Power.SchDoc, bottom right]

### Parts
C122  22µF  [C0603]
C123  22µF  [C0603]
C124  22µF  [C0603]
C125  0.22µF  [C0402]
C126  22µF  [C0603]
C127  0.22µF  [C0402]
C128  0.22µF  [C0402]
C129  0.22µF  [C0402]
C130  0.22µF  [C0402]
C131  22µF  [C0603]
C132  0.22µF  [C0402]
C133  0.22µF  [C0402]
C134  0.22µF  [C0402]
C135  0.22µF  [C0402]
C136  0.22µF  [C0402]
C137  0.22µF  [C0402]
C138  0.22µF  [C0402]
C139  22µF  [C0603]
C140  0.22µF  [C0402]
C141  0.22µF  [C0402]
C142  0.22µF  [C0402]
C143  0.22µF  [C0402]
C144  0.22µF  [C0402]
C145  0.22µF  [C0402]
C146  0.22µF  [C0402]
C147  0.22µF  [C0402]
C148  0.22µF  [C0402]
C149  0.22µF  [C0402]
C150  0.22µF  [C0402]
C151  0.22µF  [C0402]
C152  0.22µF  [C0402]
C153  0.22µF  [C0402]
C154  0.22µF  [C0402]
C155  0.22µF  [C0402]
C156  0.22µF  [C0402]
C157  0.22µF  [C0402]
C158  0.22µF  [C0402]
C159  0.22µF  [C0402]
C160  0.22µF  [C0402]
C161  0.22µF  [C0402]
C162  0.22µF  [C0402]
C163  0.22µF  [C0402]
C164  0.22µF  [C0402]
C165  10nF  [C0402]
C166  0.22µF  [C0402]
C167  0.22µF  [C0402]
C168  0.22µF  [C0402]
C169  0.22µF  [C0402]
C170  0.22µF  [C0402]
C171  0.22µF  [C0402]
C172  0.22µF  [C0402]
C173  22µF  [C0603]
C174  0.22µF  [C0402]
C175  0.22µF  [C0402]
C176  0.22µF  [C0402]
C177  0.22µF  [C0402]
C178  0.22µF  [C0402]
C179  22µF  [C0603]
C180  22µF  [C0603]
C181  0.22µF  [C0402]
C182  22µF  [C0603]
C183  22µF  [C0603]
C184  0.22µF  [C0402]
C185  0.22µF  [C0402]
C186  22µF  [C0603]
C187  0.22µF  [C0402]
C188  22µF  [C0603]
C189  0.22µF  [C0402]
C190  22µF  [C0603]
C191  0.22µF  [C0402]
C192  0.22µF  [C0402]
C193  22µF  [C0603]
FB7  BLM18SG221TN1D  [L0603]
R76  0.0  [R0402]
R77  0.0  [R0402]
R78  0.0  [R0402]
R79  0.0  [R0402]
R80  0.0  [R0402]
R81  2.2  [R0402]
R82  10  [R0402]
U11  MCIMX6Q5EYM10AC  [MCIMX6Q5EYM10AC]  (part B of 15)

### Ports
+1V2_ETH (in), +1V375 (in), +2V5 (in), +3V0 (in), +3V3 (in)

### Nets
+1V1_VDDSOC_CAP: C148.2 C158.1 C163.1 C170.1 C177.1 C184.1 C187.1 C190.2 U11.N12(VDD_CACHE_CAP) U11.R10(VDDSOC_CAP_1) U11.T10(VDDSOC_CAP_2) U11.T13(VDDSOC_CAP_3) U11.T14(VDDSOC_CAP_4) U11.U10(VDDSOC_CAP_5) U11.U13(VDDSOC_CAP_6) U11.U14(VDDSOC_CAP_7)
+1V2_ETH: R80.1 ; port +1V2_ETH
+1V375: C126.2 C128.1 C130.1 C131.2 C133.1 C134.1 C136.1 C137.1 C140.1 C141.1 C145.1 C146.1 FB7.1 R81.2 U11.H14(VDDARM_IN_1) U11.J14(VDDARM_IN_2) U11.K9(VDDARM23_IN_1) U11.K14(VDDARM_IN_3) U11.L9(VDDARM23_IN_2) U11.L14(VDDARM_IN_4) U11.M9(VDDARM23_IN_3) U11.M14(VDDARM_IN_5) U11.N9(VDDARM23_IN_4) U11.N14(VDDARM_IN_6) U11.P9(VDDARM23_IN_5) U11.P14(VDDARM_IN_7) U11.R9(VDDARM23_IN_6) U11.R14(VDDARM_IN_8) U11.T9(VDDARM23_IN_7) U11.U9(VDDARM23_IN_8) ; port +1V375
+2V5: C174.1 R76.1 R77.2 R78.2 ; port +2V5
+3V0: C139.2 C143.1 C144.1 U11.G11(VDD_SNVS_IN) U11.H9(VDDHIGH_IN_1) U11.J9(VDDHIGH_IN_2) ; port +3V0
+3V3: C150.2 C151.2 C152.2 C153.2 C154.2 C155.2 C160.1 C166.1 C173.1 C180.1 R79.2 U11.G14(NVCC_SD3) U11.G15(NVCC_NANDF) U11.G16(NVCC_SD1) U11.G17(NVCC_SD2) U11.J7(NVCC_JTAG) U11.K19(NVCC_EIM0) U11.L19(NVCC_EIM1) U11.M19(NVCC_EIM2) U11.P7(NVCC_GPIO) U11.P19(NVCC_LCD) ; port +3V3
GND: C122.1 C123.1 C124.1 C125.2 C126.1 C127.2 C128.2 C129.2 C130.2 C131.1 C132.2 C133.2 C134.2 C135.2 C136.2 C137.2 C138.2 C139.1 C140.2 C141.2 C142.2 C143.2 C144.2 C145.2 C146.2 C147.2 C148.1 C149.1 C150.1 C151.1 C152.1 C153.1 C154.1 C155.1 C156.2 C157.2 C158.2 C159.2 C160.2 C161.2 C162.2 C163.2 C164.2 C165.1 C166.2 C167.2 C168.2 C169.2 C170.2 C171.2 C172.2 C173.2 C174.2 C175.2 C176.2 C177.2 C178.2 C179.1 C180.2 C181.2 C182.1 C183.1 C184.2 C185.2 C186.2 C187.2 C188.1 C189.2 C190.1 C191.2 C192.2 C193.2 R82.2 U11.A4(GND_3) U11.A5(FA_ANA) U11.A8(GND_4) U11.A13(GND_1) U11.A25(GND_2) U11.AA7(GND_10) U11.AA10(GND_5) U11.AA13(GND_6) U11.AA16(GND_7) U11.AA19(GND_8) U11.AA22(GND_9) U11.AB3(GND_12) U11.AB24(GND_11) U11.AD4(GND_18) U11.AD7(GND_19) U11.AD10(GND_13) U11.AD13(GND_14) U11.AD16(GND_15) U11.AD19(GND_16) U11.AD22(GND_17) U11.AE1(GND_20) U11.AE25(GND_21) U11.B4(GND_22) U11.B5(VDD_FA) U11.C1(GND_23) U11.C4(GND_25) U11.C6(GND_26) U11.C10(GND_24) U11.D3(GND_27) U11.D6(GND_28) U11.D8(GND_29) U11.E5(GND_30) U11.E6(GND_31) U11.E7(GND_32) U11.F5(GND_33) U11.F6(GND_34) U11.F7(GND_35) U11.F8(GND_36) U11.G3(GND_39) U11.G10(GND_37) U11.G19(GND_38) U11.H8(GND_43) U11.H12(GND_40) U11.H15(GND_41) U11.H18(GND_42) U11.J2(GND_47) U11.J8(GND_48) U11.J12(GND_44) U11.J15(GND_45) U11.J18(GND_46) U11.K8(GND_53) U11.K10(GND_49) U11.K12(GND_50) U11.K15(GND_51) U11.K18(GND_52) U11.L2(GND_58) U11.L5(GND_59) U11.L8(GND_60) U11.L10(GND_54) U11.L12(GND_55) U11.L15(GND_56) U11.L18(GND_57) U11.M8(GND_65) U11.M10(GND_61) U11.M12(GND_62) U11.M15(GND_63) U11.M18(GND_64) U11.N8(GND_69) U11.N10(GND_66) U11.N15(GND_67) U11.N18(GND_68) U11.P8(GND_74) U11.P10(GND_70) U11.P12(GND_71) U11.P15(GND_72) U11.P18(GND_73) U11.R8(GND_78) U11.R12(GND_75) U11.R15(GND_76) U11.R17(GND_77) U11.T8(GND_84) U11.T11(GND_79) U11.T12(GND_80) U11.T15(GND_81) U11.T17(GND_82) U11.T19(GND_83) U11.U8(GND_89) U11.U11(GND_85) U11.U12(GND_86) U11.U15(GND_87) U11.U17(GND_88) U11.U19(GND_90) U11.V8(GND_91) U11.V19(GND_92) U11.W3(GND_93) U11.W7(GND_94) U11.W8(GND_95) U11.W9(GND_96) U11.W10(GND_97) U11.W11(GND_98) U11.W12(GND_99) U11.W13(GND_100) U11.W15(GND_101) U11.W16(GND_102) U11.W17(GND_103) U11.W18(GND_104) U11.W19(GND_105) U11.Y5(GND_106) U11.Y24(GND_107)
+1V2_VDD: C156.1 C157.1 C161.1 C162.1 C168.1 C169.1 C175.1 C176.1 C182.2 C183.2 U11.H11(VDDARM23_CAP_1) U11.H13(VDDARM_CAP_1) U11.J11(VDDARM23_CAP_2) U11.J13(VDDARM_CAP_2) U11.K11(VDDARM23_CAP_3) U11.K13(VDDARM_CAP_3) U11.L11(VDDARM23_CAP_4) U11.L13(VDDARM_CAP_4) U11.M11(VDDARM23_CAP_5) U11.M13(VDDARM_CAP_5) U11.N11(VDDARM23_CAP_6) U11.N13(VDDARM_CAP_6) U11.P11(VDDARM23_CAP_7) U11.P13(VDDARM_CAP_7) U11.R11(VDDARM23_CAP_8) U11.R13(VDDARM_CAP_8)
+1V375_BEAD: C122.2 C123.2 C124.2 C125.1 C127.1 C129.1 C132.1 C135.1 C138.1 C142.1 C147.1 FB7.2 U11.H16(VDDSOC_IN_1) U11.J16(VDDSOC_IN_2) U11.K16(VDDSOC_IN_3) U11.L16(VDDSOC_IN_4) U11.M16(VDDSOC_IN_5) U11.N16(VDDSOC_IN_6) U11.P16(VDDSOC_IN_7) U11.R16(VDDSOC_IN_8) U11.T16(VDDSOC_IN_9) U11.U16(VDDSOC_IN_10)
+VDDPU: C159.1 C164.1 C171.1 C178.1 C185.1 C188.2 U11.H17(VDDPU_CAP_1) U11.J17(VDDPU_CAP_2) U11.K17(VDDPU_CAP_3) U11.L17(VDDPU_CAP_4) U11.M17(VDDPU_CAP_5) U11.N17(VDDPU_CAP_6) U11.P17(VDDPU_CAP_7)
NetC149_2: C149.2 U11.G9(VDD_SNVS_CAP)
NetC165_2: C165.2 C172.1 C179.2 U11.H10(VDDHIGH_CAP_1) U11.J10(VDDHIGH_CAP_2)
NetC167_1: C167.1 R76.2 U11.G18(NVCC_RGMII)
NetC181_1: C181.1 C186.1 R77.1 U11.R19(NVCC_ENET)
NetC189_1: C189.1 R78.1 U11.K7(NVCC_MIPI)
NetC191_1: C191.1 R79.1 U11.N7(NVCC_CSI)
NetC192_1: C192.1 C193.1 R80.2 R81.1 R82.1 U11.E8(NVCC_PLL_OUT)

Not connected (* = marked no-connect by the designer): U11 C8(GPANAIO)*

### Notes on the sheet
- CPU POWER
- DESIGN NOTES
- STRAPPING OPTIONS:
  1. GPANAIO must be a no connect
  2. VDD_FA and FA_ANA should be tied to GND
  3. +NVCC_RGMII connected to 2V5 for RGMII 2V5 operation
  4. +NVCC_ENET connected to 2V5 to be able to easy connect cpu with ethernet phy (which is supplied from 2V5)
  POWER SUPPLY
  1. For testing purpuse only: Set +1V375 to +1.24V (when LDO VDDARM, VDDARM23 and VDDSOC are disabled) to lower power dissipation
  2. Disable LDOs for VDDARM_IN, VDDARM23_IN and VDDSOC_IN
  LAYOUT
  1. It is critical that the bulk and decoupling capacitors placed on the VDDARM_CAP, VDDARM23_CAP, VDDSOC_CAP and VDDPU rails be placed directly underneath the processors. Development testing has shown that proper placement of the capacitors can reduce ripple on the voltage rails by as much as 50% compared to placing capacitors outside the physical boundaries of the processor. These will result in more stable processor operations
  POPULATION
  1. +1V1_NVCC_PLL_OUT: R77, R79, R105 for testing only
  2. Measure +1V1_NVCC_PLL_OUT, if needed fit R77, R79
  3. The VDDARM_CAP and VDDARM23_CAP rails have been optimized for use with the i.MX 6 Quad and i.MX 6 DualLite processors.  To achieve the lowest power mode (preventing internal leakage) when using the i.MX 6 Dual and the i.MX 6 SoloLite processors, VDDARM_CAP should be split from VDDARM23_CAP and the VDDARM23_CAP pins should be connected to ground. This can be done on a single board configured for use with all four processors by placing a Zero Ohm resistor between the VDDARM_CAP and VDDARM23_CAP rails (in place of the straight net connection). To use the board with different processors, populate the resistor when using Quad and DualLite processors and depopulate resistor when using Dual and SoloLite processors. When using Dual and SoloLite processors, depopulate the capacitors attached to VDDARM23_CAP pins and replace one of the capacitors with a zero Ohm resistor to short pins to ground. The configuration in this schematic will work with all four processors, but will not result in the most power optimized configuration for the i.MX 6 Dual and Solo processors
- Title:
- Date:
- Size C
- Project:
- Number:
- Time:
- Sheet
- Revision
- of
- Engineer:
- File:
- (in symbol MCIMX6Q5EYM10AC, part B) i.MX6Q - POWER

### Library data of the parts
C122-C124 C126 C131 C139 C173 C179 C180 C182 C183 C186 C188 C190 C193 = GRM188R60G226MEA0L: CAP CER 22UF 4V 20% X5R 0603; Manufacturer 1: Murata Electronics North America; Supplier 1: Digi-Key; Supplier Part Number 1: 490-5526-1-ND; Manufacturer Part Number 1: GRM188R60G226MEA0L; Capacitance: 22µF; Voltage: 4V; ComponentLink1URL: http://www.murata.com/products/catalog/pdf/c02e.pdf; ComponentLink1Description: http://www.murata.com/products/catalog/pdf/c02e.pdf
C125 C127-C130 C132-C138 C140-C164 C166-C172 C174-C178 C181 C184 C185 C187 C189 C191 C192 = C1005X5R1E224M: CAP CER .22UF 25V X5R 20% 0402; Manufacturer 1: TDK Corporation; Capacitance: 0.22µF; Manufacturer Part Number 1: C1005X5R1E224M; Voltage: 25V; Supplier 1: Digi-Key; Supplier Part Number 1: 445-5945-1-ND; ComponentLink1URL: http://www.tdk.co.jp/tefe02/e412_c.pdf; ComponentLink1Description: http://www.tdk.co.jp/tefe02/e412_c.pdf
C165 = C1005X7R1C103K: CAP CER 10000PF 16V X7R 10% 0402; Manufacturer: TDK Corporation; Capacitance: 10nF; Manufacturer Part Number: C1005X7R1C103K; Voltage: 16V; Supplier 1: Digi-Key; Supplier Part Number 1: 445-1262-1-ND; ComponentLink1URL: http://www.tdk.co.jp/tefe02/e412_c.pdf; ComponentLink1Description: http://www.tdk.co.jp/tefe02/e412_c.pdf
FB7 = BLM18SG221TN1D: FERRITE CHIP 220 OHM 2500MA 0603; Manufacturer 1: Murata Electronics North America; Supplier 1: Digi-Key; Supplier Part Number 1: 490-5225-1-ND; Manufacturer Part Number 1: BLM18SG221TN1D; ComponentLink1URL: http://search.murata.co.jp/Ceramy/image/img/PDF/ENG/L0110S0100BLM18S.pdf; ComponentLink1Description: http://search.murata.co.jp/Ceramy/image/img/PDF/ENG/L0110S0100BLM18S.pdf
R76-R80 = RC0402JR-070RL: RES 0.0 OHM 1/16W 0402 SMD; Manufacturer 1: Yageo; Manufacturer Part Number 1: RC0402JR-070RL; Resistance: 0.0; Supplier 1: Digi-Key; Supplier Part Number 1: 311-0.0JRCT-ND; ComponentLink1URL: http://www.yageo.com/documents/recent/PYu-RC0402_51_RoHS_L_6.pdf; ComponentLink1Description: http://www.yageo.com/documents/recent/PYu-RC0402_51_RoHS_L_6.pdf
R81 = CRCW04022R20FKED: RES 2.20 OHM 1/16W 1% 0402 SMD; Manufacturer 1: Vishay Dale; Supplier 1: Digi-Key; Supplier Part Number 1: 541-2.20LLCT-ND; Manufacturer Part Number 1: CRCW04022R20FKED; Resistance: 2.2; ComponentLink1URL: http://www.vishay.com/docs/20035/dcrcwe3.pdf; ComponentLink1Description: http://www.vishay.com/docs/20035/dcrcwe3.pdf
R82 = RC0402FR-0710RL: RES 10.0 OHM 1/16W 1% 0402 SMD; Manufacturer 1: Yageo; Manufacturer Part Number 1: RC0402FR-0710RL; Resistance: 10; Supplier 1: Digi-Key; Supplier Part Number 1: 311-10.0LRCT-ND; ComponentLink1URL: http://www.yageo.com/documents/recent/PYu-RC0402_51_RoHS_L_6.pdf; ComponentLink1Description: http://www.yageo.com/documents/recent/PYu-RC0402_51_RoHS_L_6.pdf
U11 = MCIMX6Q5EYM10AC: as U11 on sheet EDU_High-Speed-Design_CPU_Unused; Supplier 1: Digi-Key; Manufacturer Part Number 1: MCIMX6Q5EYM10AC; Supplier Part Number 1: MCIMX6Q5EYM10AC-ND

## Sheet EDU_High-Speed-Design_CPU_Control.SchDoc: CPU Control
size 431 x 279 mm; Date: not used; ApprovedBy: not used; CheckedBy: not used; Author: not used; DrawnBy: not used; Engineer: Podlesnyi Vasilii; Organization: not used; Address4: not used; Revision: 0.1; SheetNumber: 25; SheetTotal: 26; ProjectTitle: EDU High-Speed Design; Time: not used; ImagePath: not used; Application_BuildNumber: not used
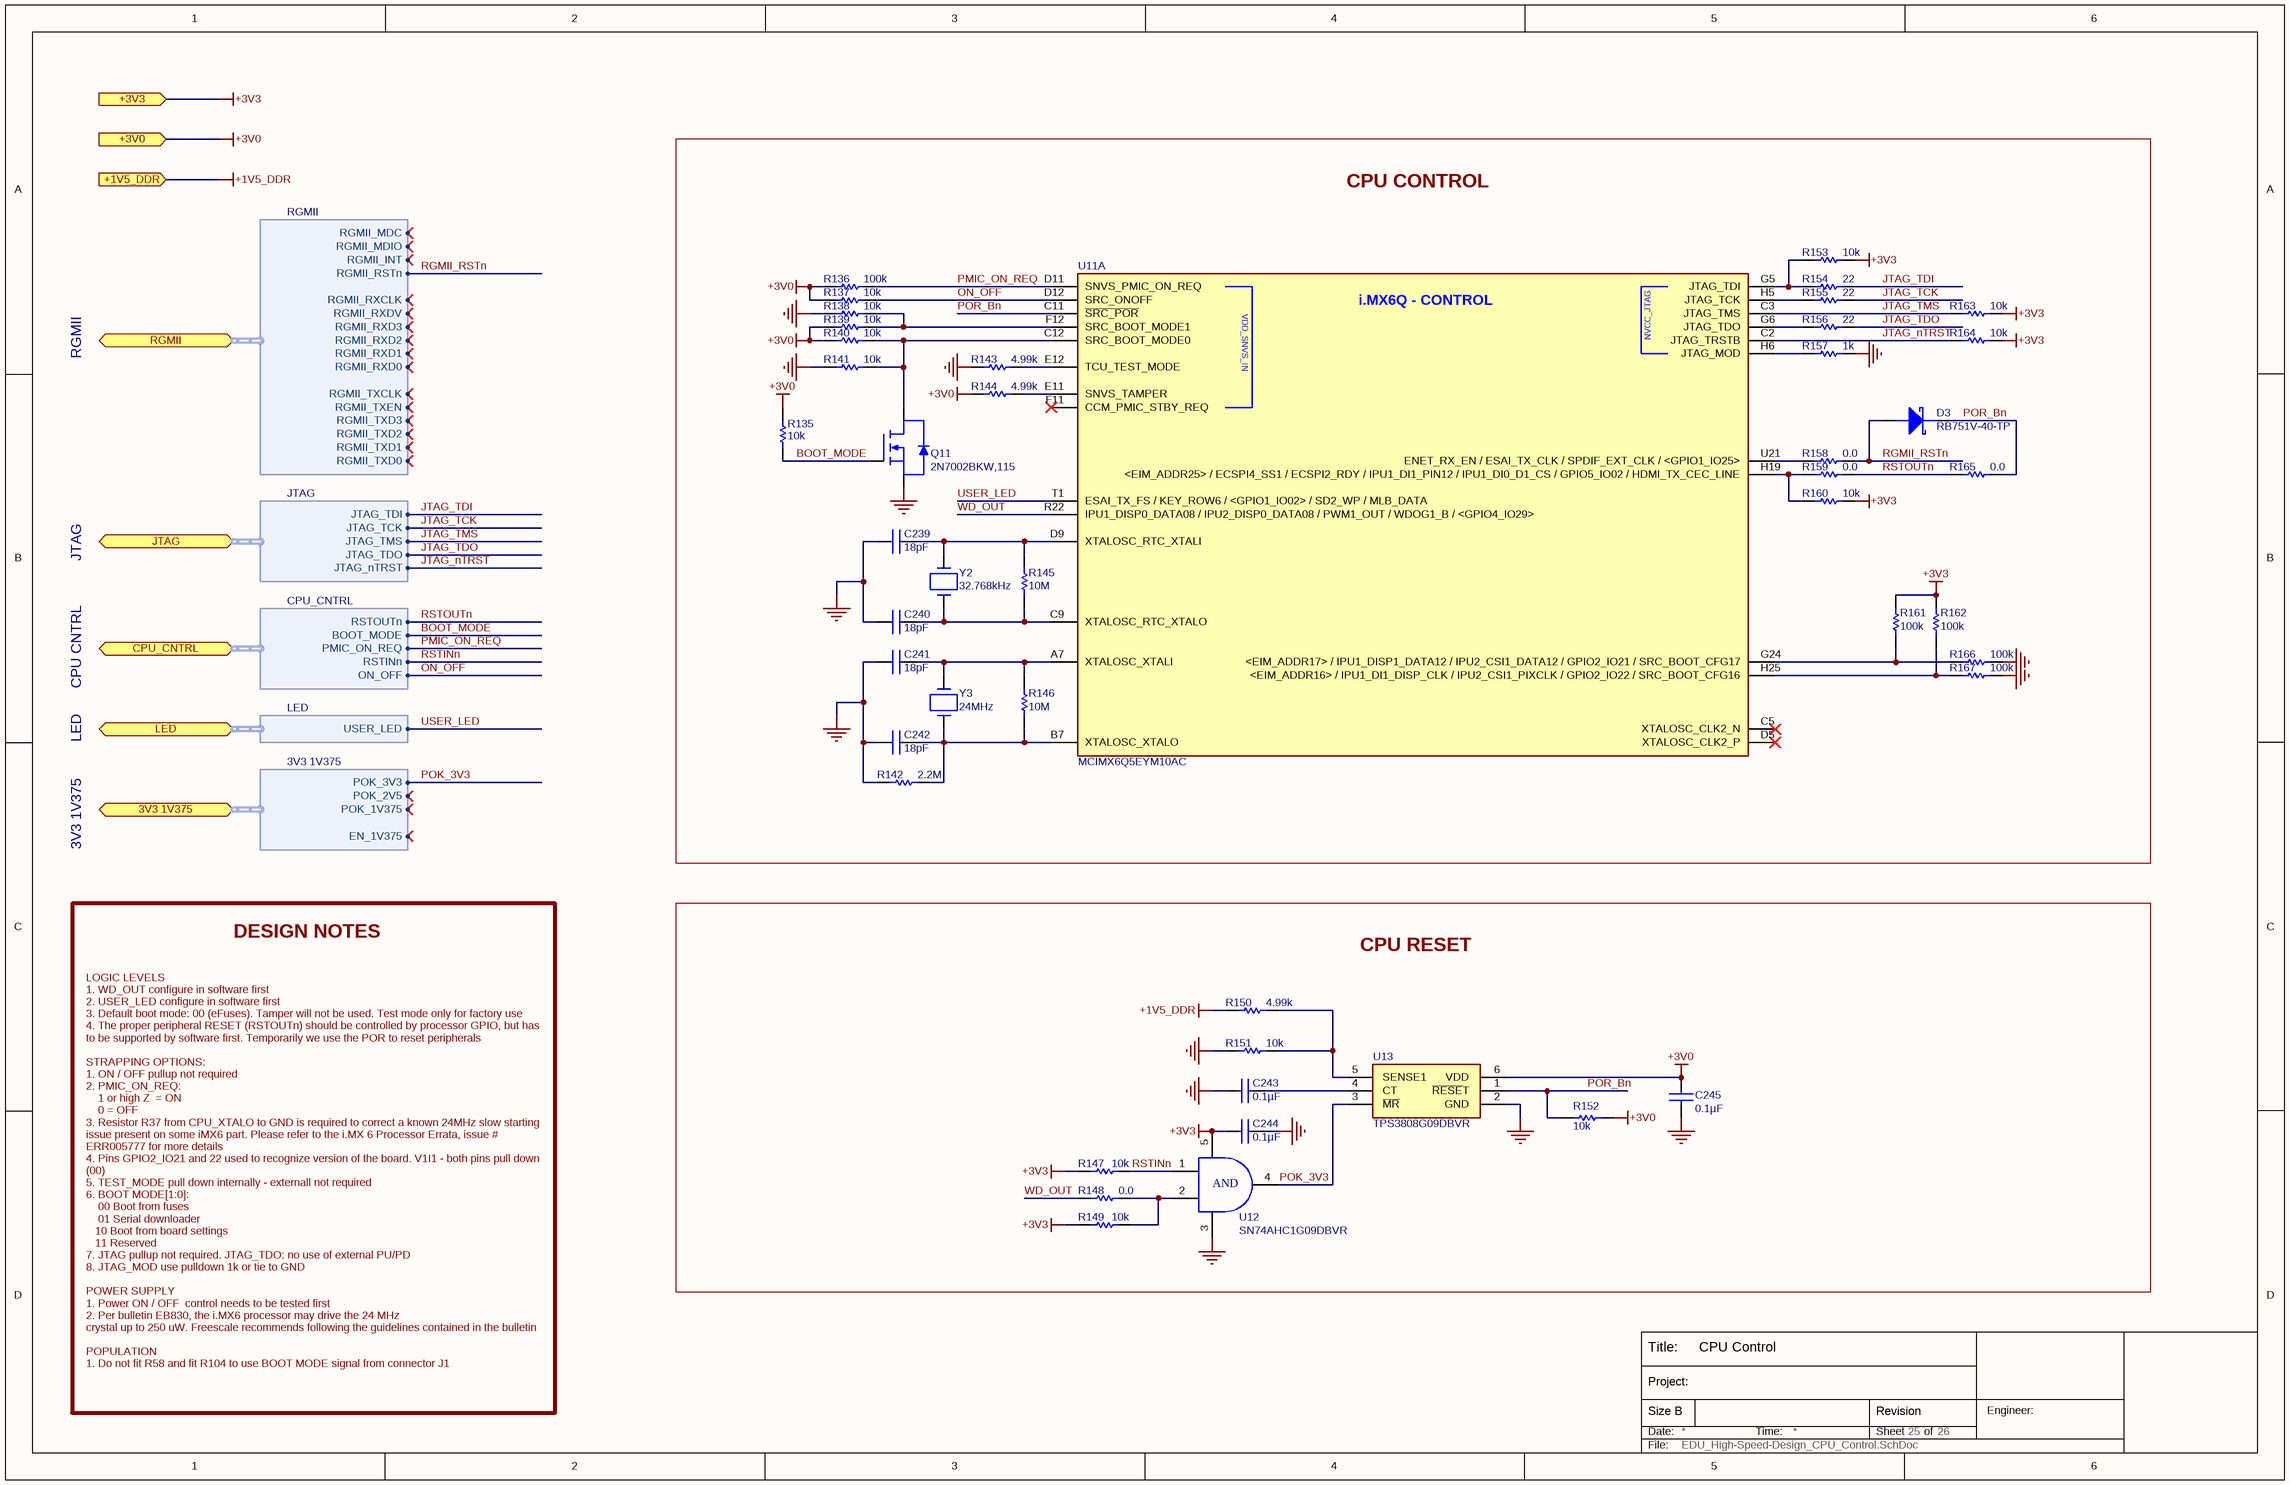
[diagram p7: EDU_High-Speed-Design_CPU_Control.SchDoc]

### Parts
C239  18pF  [C0402]
C240  18pF  [C0402]
C241  18pF  [C0402]
C242  18pF  [C0402]
C243  0.1µF  [C0402]
C244  0.1µF  [C0402]
C245  0.1µF  [C0402]
D3  RB751V-40-TP  [SOD-323]
Q11  2N7002BKW,115  [SOT-23-3]
R135  10k  [R0402]
R136  100k  [R0402]
R137  10k  [R0402]
R138  10k  [R0402]
R139  10k  [R0402]
R140  10k  [R0402]
R141  10k  [R0402]
R142  2.2M  [R0402]
R143  4.99k  [R0402]
R144  4.99k  [R0402]
R145  10M  [R0402]
R146  10M  [R0402]
R147  10k  [R0402]
R148  0.0  [R0402]
R149  10k  [R0402]
R150  4.99k  [R0402]
R151  10k  [R0402]
R152  10k  [R0402]
R153  10k  [R0402]
R154  22  [R0402]
R155  22  [R0402]
R156  22  [R0402]
R157  1k  [R0402]
R158  0.0  [R0402]
R159  0.0  [R0402]
R160  10k  [R0402]
R161  100k  [R0402]
R162  100k  [R0402]
R163  10k  [R0402]
R164  10k  [R0402]
R165  0.0  [R0402]
R166  100k  [R0402]
R167  100k  [R0402]
U11  MCIMX6Q5EYM10AC  [MCIMX6Q5EYM10AC]  (part A of 15)
U12  SN74AHC1G09DBVR  [SOT-23-5]
U13  TPS3808G09DBVR  [SOT-23-6]
Y2  32.768kHz  [ABS06]
Y3  24MHz  [ABM7]

### Blocks framed on the sheet
CPU CONTROL: C239-C242 D3 Q11 R135-R146 R153-R167 U11 Y2 Y3
CPU RESET: C243-C245 R147-R152 U12 U13

### Ports
3V3 1V375 (bidir, harness 3V3 1V375), +1V5_DDR (in), +3V0 (in), +3V3 (in), CPU_CNTRL (bidir, harness CPU_CNTRL), JTAG (bidir, harness JTAG), LED (bidir, harness LED), RGMII (bidir, harness RGMII)

### Harnesses
RGMII: RGMII_TXCLK, RGMII_TXEN, RGMII_TXD2, RGMII_TXD0, RGMII_TXD1, RGMII_TXD3, RGMII_RXDV, RGMII_RXCLK, RGMII_RXD3, RGMII_RXD2, RGMII_RXD1, RGMII_RXD0, RGMII_RSTn, RGMII_INT, RGMII_MDIO, RGMII_MDC
JTAG: JTAG_TDI, JTAG_TCK, JTAG_TMS, JTAG_nTRST, JTAG_TDO
CPU_CNTRL: RSTOUTn, PMIC_ON_REQ, ON_OFF, BOOT_MODE, RSTINn
LED: USER_LED
3V3 1V375: POK_3V3, POK_1V375, POK_2V5, EN_1V375

### Nets
+1V5_DDR: R150.2 ; port +1V5_DDR
+3V0: C245.1 R135.2 R136.2 R137.1 R139.1 R140.1 R144.2 R152.1 U13.6(VDD) ; port +3V0
+3V3: C244.1 R147.2 R149.2 R153.2 R160.2 R161.1 R162.1 R163.2 R164.2 U12.5(VCC) ; port +3V3
GND: C239.1 C240.1 C241.1 C242.1 C243.1 C244.2 C245.2 Q11.2(S) R138.1 R141.1 R142.2 R143.2 R151.2 R157.1 R166.2 R167.2 U12.3(GND) U13.2(GND)
BOOT_MODE: Q11.1(G) R135.1 ; port CPU_CNTRL.BOOT_MODE
JTAG_nTRST: R164.1 U11.C2(JTAG_TRSTB) ; port JTAG.JTAG_nTRST
JTAG_TCK: R155.1 ; port JTAG.JTAG_TCK
JTAG_TDI: R154.1 ; port JTAG.JTAG_TDI
JTAG_TDO: R156.1 ; port JTAG.JTAG_TDO
JTAG_TMS: R163.1 U11.C3(JTAG_TMS) ; port JTAG.JTAG_TMS
ON_OFF: R137.2 U11.D12(SRC_ONOFF) ; port CPU_CNTRL.ON_OFF
PMIC_ON_REQ: R136.1 U11.D11(SNVS_PMIC_ON_REQ) ; port CPU_CNTRL.PMIC_ON_REQ
POK_3V3: U12.4(Y) U13.3(~{MR}) ; port 3V3 1V375.POK_3V3
POR_Bn: D3.1(cathode) R152.2 R165.2 U11.C11(~{SRC_POR}) U13.1(~{RESE}T)
RGMII_RSTn: D3.2(ANODE) R158.2 ; port RGMII.RGMII_RSTn
RSTINn: R147.1 U12.1(A) ; port CPU_CNTRL.RSTINn
RSTOUTn: R159.2 R165.1 ; port CPU_CNTRL.RSTOUTn
USER_LED: U11.T1(ESAI_TX_FS_/_KEY_ROW6_/_<GPIO1_IO02>_/_SD2_WP_/_MLB_DATA) ; port LED.USER_LED
WD_OUT: R148.1 U11.R22(IPU1_DISP0_DATA08_/_IPU2_DISP0_DATA08_/_PWM1_OUT_/_WDOG1_B_/_<GPIO4_IO29>)
NetC239_2: C239.2 R145.1 U11.D9(XTALOSC_RTC_XTALI) Y2.2
NetC240_2: C240.2 R145.2 U11.C9(XTALOSC_RTC_XTALO) Y2.1
NetC241_2: C241.2 R146.1 U11.A7(XTALOSC_XTALI) Y3.2
NetC242_2: C242.2 R142.1 R146.2 U11.B7(XTALOSC_XTALO) Y3.1
NetC243_2: C243.2 U13.4(CT)
NetQ11_3: Q11.3(D) R140.2 R141.2 U11.C12(SRC_BOOT_MODE0)
NetR138_2: R138.2 R139.2 U11.F12(SRC_BOOT_MODE1)
NetR143_1: R143.1 U11.E12(TCU_TEST_MODE)
NetR144_1: R144.1 U11.E11(SNVS_TAMPER)
NetR148_2: R148.2 R149.1 U12.2(B)
NetR150_1: R150.1 R151.1 U13.5(SENSE1)
NetR153_1: R153.1 R154.2 U11.G5(JTAG_TDI)
NetR155_2: R155.2 U11.H5(JTAG_TCK)
NetR156_2: R156.2 U11.G6(JTAG_TDO)
NetR157_2: R157.2 U11.H6(JTAG_MOD)
NetR158_1: R158.1 U11.U21(ENET_RX_EN_/_ESAI_TX_CLK_/_SPDIF_EXT_CLK_/_<GPIO1_IO25>)
NetR159_1: R159.1 R160.1 U11.H19(<EIM_ADDR25>_/_ECSPI4_SS1_/_ECSPI2_RDY_/_IPU1_DI1_PIN12_/_IPU1_DI0_D1_CS_/_GPIO5_IO02_/_HDMI_TX_CEC_LINE)
NetR161_2: R161.2 R166.1 U11.G24(<EIM_ADDR17>_/_IPU1_DISP1_DATA12_/_IPU2_CSI1_DATA12_/_GPIO2_IO21_/_SRC_BOOT_CFG17)
NetR162_2: R162.2 R167.1 U11.H25(<EIM_ADDR16>_/_IPU1_DI1_DISP_CLK_/_IPU2_CSI1_PIXCLK_/_GPIO2_IO22_/_SRC_BOOT_CFG16)

Not connected (* = marked no-connect by the designer): U11 C5(XTALOSC_CLK2_N)* D5(XTALOSC_CLK2_P)* F11(CCM_PMIC_STBY_REQ)*

### Notes on the sheet
- RGMII
- JTAG
- CPU CNTRL
- LED
- 3V3 1V375
- DESIGN NOTES
- LOGIC LEVELS
  1. WD_OUT configure in software first
  2. USER_LED configure in software first
  3. Default boot mode: 00 (eFuses). Tamper will not be used. Test mode only for factory use
  4. The proper peripheral RESET (RSTOUTn) should be controlled by processor GPIO, but has to be supported by software first. Temporarily we use the POR to reset peripherals
  STRAPPING OPTIONS:
  1. ON / OFF pullup not required
  2. PMIC_ON_REQ:
  1 or high Z  = ON
  0 = OFF
  3. Resistor R37 from CPU_XTALO to GND is required to correct a known 24MHz slow starting issue present on some iMX6 part. Please refer to the i.MX 6 Processor Errata, issue # ERR005777 for more details
  4. Pins GPIO2_IO21 and 22 used to recognize version of the board. V1I1 - both pins pull down (00)
  5. TEST_MODE pull down internally - externall not required
  6. BOOT MODE[1:0]:
  00 Boot from fuses
  01 Serial downloader
  10 Boot from board settings
  11 Reserved
  7. JTAG pullup not required. JTAG_TDO: no use of external PU/PD
  8. JTAG_MOD use pulldown 1k or tie to GND
  POWER SUPPLY
  1. Power ON / OFF  control needs to be tested first
  2. Per bulletin EB830, the i.MX6 processor may drive the 24 MHz
  crystal up to 250 uW. Freescale recommends following the guidelines contained in the bulletin
  POPULATION
  1. Do not fit R58 and fit R104 to use BOOT MODE signal from connector J1
- Title:
- Date:
- Size B
- Project:
- Time:
- Sheet
- Revision
- of
- Engineer:
- File:
- (in symbol MCIMX6Q5EYM10AC, part A) i.MX6Q - CONTROL
- (in symbol SN74AHC1G09DBVR) AND

### Library data of the parts
C239-C242 = C1005C0G1H180J: CAP CER 18PF 50V C0G 5% 0402; Manufacturer 1: TDK Corporation; Capacitance: 18pF; Manufacturer Part Number 1: C1005C0G1H180J; Supplier 1: Digi-Key; Supplier Part Number 1: 445-1238-1-ND; ComponentLink1URL: http://www.tdk.co.jp/tefe02/e412_c.pdf; ComponentLink1Description: http://www.tdk.co.jp/tefe02/e412_c.pdf; Voltage: 50V
C243-C245 = C1005X5R1H104K: CAP CER .10UF 50V X5R 10% 0402; Manufacturer 1: TDK Corporation; Capacitance: 0.1µF; Manufacturer Part Number 1: C1005X5R1H104K; Voltage: 50V; Supplier 1: Digi-Key; Supplier Part Number 1: 445-5942-1-ND; ComponentLink1URL: http://www.tdk.co.jp/tefe02/e412_c.pdf; ComponentLink1Description: http://www.tdk.co.jp/tefe02/e412_c.pdf
D3 = RB751V-40-TP: DIODE SCHTKY 30MA 30V SOD-323; Manufacturer 1: Micro Commercial Co; Supplier 1: Digi-Key; Supplier Part Number 1: RB751V-40-TPMSCT-ND; Manufacturer Part Number 1: RB751V-40-TP
Q11 = 2N7002BKW,115: MOSFET N-CH 60V 310MA SOT323; Manufacturer 1: NXP Semiconductors; Supplier 1: Digi-Key; Supplier Part Number 1: 568-5980-1-ND; Manufacturer Part Number 1: 2N7002BKW,115; ComponentLink1URL: http://www.nxp.com/documents/data_sheet/2N7002BKW.pdf; ComponentLink1Description: http://www.nxp.com/documents/data_sheet/2N7002BKW.pdf
R135 R137-R141 R147 R149 R151-R153 R160 R163 R164 = RC0402FR-0710KL: RES 10.0K OHM 1/16W 1% 0402 SMD; Manufacturer 1: Yageo; Manufacturer Part Number 1: RC0402FR-0710KL; Resistance: 10k; Supplier 1: Digi-Key; Supplier Part Number 1: 311-10.0KLRCT-ND; ComponentLink1URL: http://www.yageo.com/documents/recent/PYu-RC0402_51_RoHS_L_6.pdf; ComponentLink1Description: http://www.yageo.com/documents/recent/PYu-RC0402_51_RoHS_L_6.pdf
R136 R161 R162 R166 R167 = RMCF0402FT100K: RES 100K OHM 1/16W 1% 0402 SMD; Manufacturer 1: Stackpole Electronics Inc; Manufacturer Part Number 1: RMCF0402FT100K; Resistance: 100k; Supplier 1: Digi-Key; Supplier Part Number 1: RMCF0402FT100KCT-ND; ComponentLink1URL: http://www.seielect.com/Catalog/SEI-RMCF.pdf; ComponentLink1Description: http://www.seielect.com/Catalog/SEI-RMCF.pdf
R142 = CRCW04022M20FKED: RES 2.20M OHM 1/16W 1% 0402 SMD; Manufacturer 1: Vishay Dale; Supplier 1: Digi-Key; Manufacturer Part Number 1: CRCW04022M20FKED; Resistance: 2.2M; ComponentLink1URL: http://www.vishay.com/doc?20035; ComponentLink1Description: http://www.vishay.com/doc?20035; Supplier Part Number 1: 541-2.20MLCT-ND
R143 R144 R150 = RMCF0402FT4K99: RES TF 4.99K OHM 1% 1/16W 0402; Manufacturer 1: Stackpole Electronics Inc; Manufacturer Part Number 1: RMCF0402FT4K99; Resistance: 4.99k; Supplier 1: Digi-Key; Supplier Part Number 1: RMCF0402FT4K99CT-ND; ComponentLink1URL: http://www.seielect.com/Catalog/SEI-RMCF.pdf; ComponentLink1Description: http://www.seielect.com/Catalog/SEI-RMCF.pdf
R145 R146 = CRCW040210M0FKED: RES 10.0M OHM 1/16W 1% 0402 SMD; Manufacturer 1: Vishay Dale; Supplier 1: Digi-Key; Supplier Part Number 1: 541-10.0MLCT-ND; Manufacturer Part Number 1: CRCW040210M0FKED; Resistance: 10M; ComponentLink1URL: http://www.vishay.com/doc?20035; ComponentLink1Description: http://www.vishay.com/doc?20035
R148 R158 R159 R165 = RC0402JR-070RL: as R76 on sheet EDU_High-Speed-Design_CPU_Power; Manufacturer Part Number 1: RC0402JR-070RL; Resistance: 0.0; Supplier 1: Digi-Key; Supplier Part Number 1: 311-0.0JRCT-ND; ComponentLink1URL: http://www.yageo.com/documents/recent/PYu-RC0402_51_RoHS_L_6.pdf; ComponentLink1Description: http://www.yageo.com/documents/recent/PYu-RC0402_51_RoHS_L_6.pdf
R154-R156 = RC0402FR-0722RL: RES 22.0 OHM 1/16W 1% 0402 SMD; Manufacturer 1: Yageo; Manufacturer Part Number 1: RC0402FR-0722RL; Resistance: 22; Supplier 1: Digi-Key; Supplier Part Number 1: 311-22.0LRCT-ND; ComponentLink1URL: http://www.yageo.com/documents/recent/PYu-RC0402_51_RoHS_L_6.pdf; ComponentLink1Description: http://www.yageo.com/documents/recent/PYu-RC0402_51_RoHS_L_6.pdf
R157 = RC0402FR-071KL: RES 1.00K OHM 1/16W 1% 0402 SMD; Manufacturer 1: Yageo; Manufacturer Part Number 1: RC0402FR-071KL; Resistance: 1k; Supplier 1: Digi-Key; Supplier Part Number 1: 311-1.00KLRCT-ND; ComponentLink1URL: http://www.yageo.com/documents/recent/PYu-RC0402_51_RoHS_L_6.pdf; ComponentLink1Description: http://www.yageo.com/documents/recent/PYu-RC0402_51_RoHS_L_6.pdf
U11 = MCIMX6Q5EYM10AC: as U11 on sheet EDU_High-Speed-Design_CPU_Unused; Supplier 1: Digi-Key; Manufacturer Part Number 1: MCIMX6Q5EYM10AC; Supplier Part Number 1: MCIMX6Q5EYM10AC-ND
U12 = SN74AHC1G09DBVR: IC GATE AND SGL 2INP SOT23-5; Manufacturer: Texas Instruments; Logic Type: AND Gate; Number of Circuits: 1; Number of Inputs: 2; Voltage - Supply: 2 V ~ 5.5 V; Current - Quiescent (Max): 1µA; Current - Output High, Low: -, 8mA; Logic Level - Low: 0.5 V ~ 1.65 V; Logic Level - High: 1.5 V ~ 3.85 V; Max Propagation Delay @ V, Max CL: 7.5ns @ 5V, 50pF; .Creator: MM; .Checked PCB: RF, used by MM; .Checked SCH: MM, checked by RF; Supplier 1: Digi-Key; Manufacturer Part Number: SN74AHC1G09DBVR; RoHS: RoHS Compliant; Category: Integrated Circuits (ICs); Stock 1: 3468; Pricing 1: 1=0.49, 10=0.345, 25=0.2836, 100=0.2265, 250=0.165, 500=0.134, 1000=0.103 (USD); Features: Open Drain; Operating Temperature: -55°C ~ 125°C; Mounting Type: Surface Mount; Supplier Device Package: SOT-23-5; Package / Case: SC-74A, SOT-753; Packaging: Cut Tape (CT); ComponentLink1URL: http://www.ti.com/lit/ds/symlink/sn74ahc1g09.pdf; ComponentLink1Description: http://www.ti.com/lit/ds/symlink/sn74ahc1g09.pdf; Supplier Part Number 1: 296-29202-1-ND
U13 = TPS3808G09DBVR: IC VOLT SUPERVISOR 0.9V SOT23-6; Manufacturer 1: Texas Instruments; Manufacturer Part Number 1: TPS3808G09DBVR; Supplier 1: Digi-Key; Supplier Part Number 1: 296-17189-1-ND; ComponentLink1URL: http://www.ti.com/lit/ds/symlink/tps3808g01.pdf; ComponentLink1Description: http://www.ti.com/lit/ds/symlink/tps3808g01.pdf
Y2 = ABS06-32.768KHZ-9-1-T: CRYSTAL 32.768 KHZ 9.0 PF SMD; Manufacturer 1: Abracon Corporation; Manufacturer Part Number 1: ABS06-32.768KHZ-9-1-T; Frequency: 32.768kHz; Supplier 1: Digi-Key; ComponentLink1URL: http://www.abracon.com/Resonators/ABS06.pdf; ComponentLink1Description: http://www.abracon.com/Resonators/ABS06.pdf; Supplier Part Number 1: 535-10247-1-ND
Y3 = ABM7-24.000MHZ-D-2-Y-T: CRYSTAL 24.0000MHZ 18PF SMD; Manufacturer 1: Abracon Corporation; Supplier 1: Digi-Key; Manufacturer Part Number 1: ABM7-24.000MHZ-D-2-Y-T; Frequency: 24MHz; ComponentLink1URL: http://www.abracon.com/Resonators/abm7.pdf; ComponentLink1Description: http://www.abracon.com/Resonators/abm7.pdf; Supplier Part Number 1: 535-9845-1-ND

## Sheet EDU_High-Speed-Design_CPU_Uart.SchDoc: CPU Uart
size 279 x 215 mm; Date: not used; ApprovedBy: not used; CheckedBy: not used; Author: not used; DrawnBy: not used; Engineer: Podlesnyi Vasilii; Organization: not used; Address4: not used; Revision: 0.1; SheetNumber: 23; SheetTotal: 26; ProjectTitle: EDU High-Speed Design; Time: not used; ImagePath: not used; Application_BuildNumber: not used
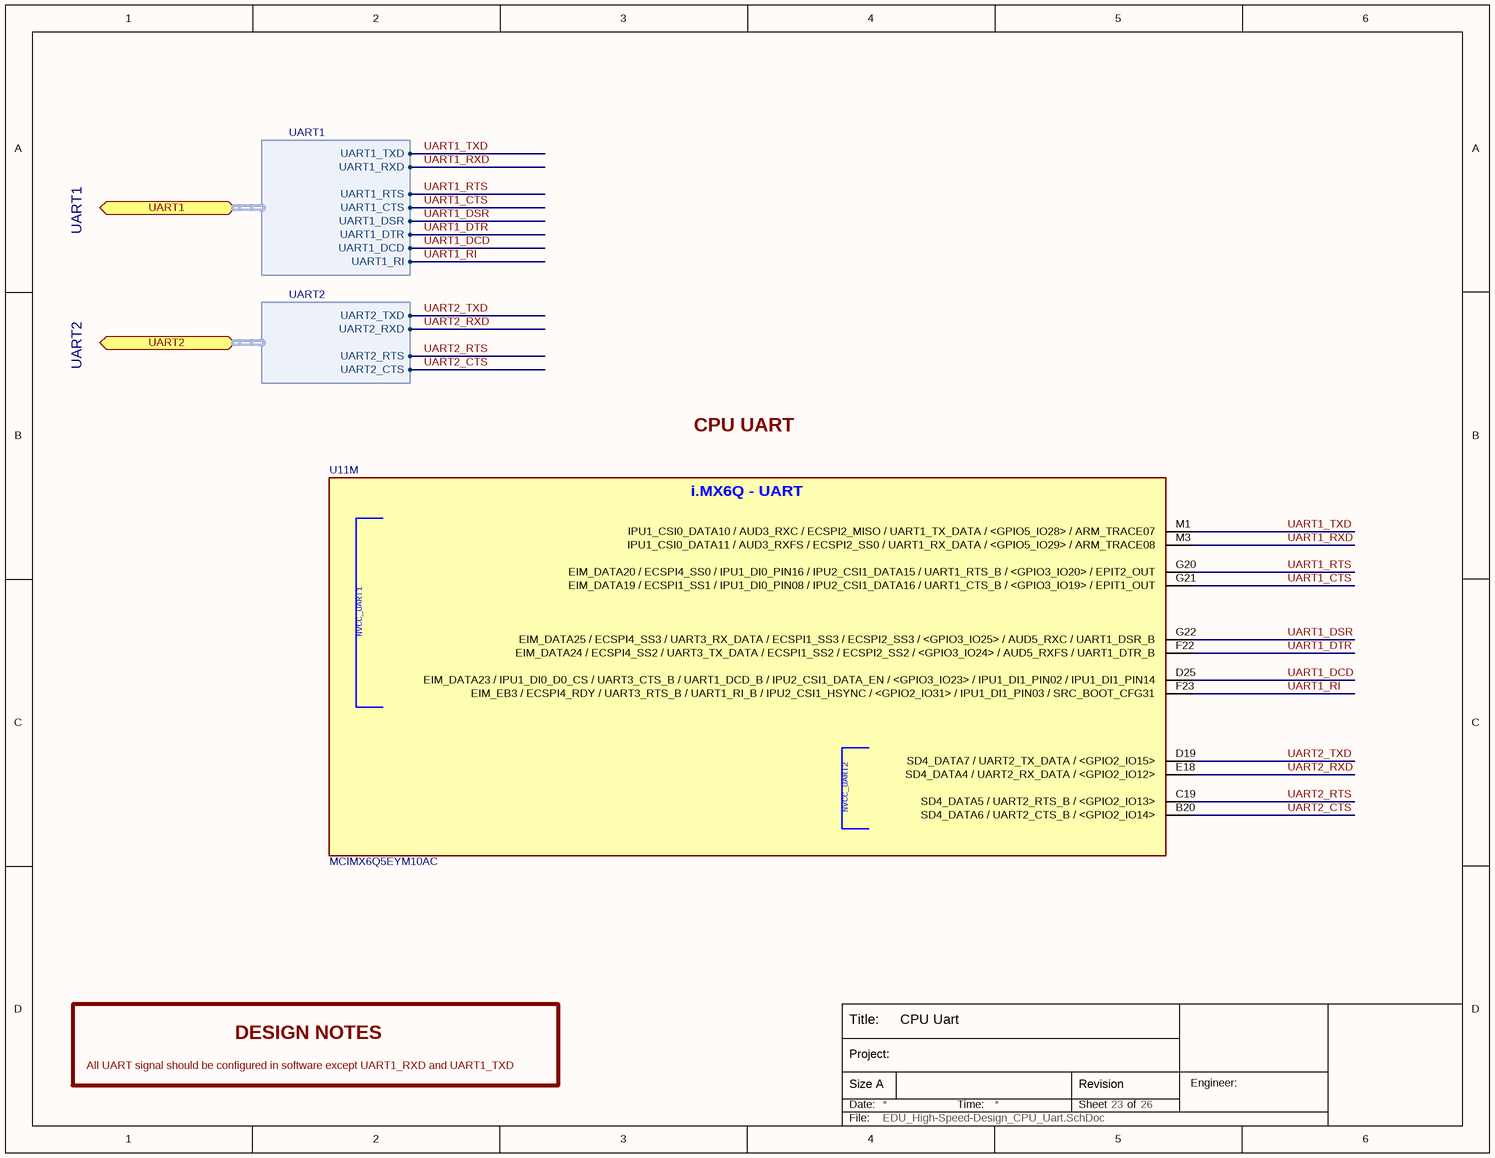
[diagram p8: EDU_High-Speed-Design_CPU_Uart.SchDoc]

### Parts
U11  MCIMX6Q5EYM10AC  [MCIMX6Q5EYM10AC]  (part M of 15)

### Ports
UART1 (bidir, harness UART1), UART2 (bidir, harness UART2)

### Harnesses
UART1: UART1_TXD, UART1_RTS, UART1_CTS, UART1_RXD, UART1_DSR, UART1_DTR, UART1_DCD, UART1_RI
UART2: UART2_TXD, UART2_RTS, UART2_CTS, UART2_RXD

### Nets
UART1_CTS: U11.G21(EIM_DATA19_/_ECSPI1_SS1_/_IPU1_DI0_PIN08_/_IPU2_CSI1_DATA16_/_UART1_CTS_B_/_<GPIO3_IO19>_/_EPIT1_OUT) ; port UART1.UART1_CTS
UART1_DCD: U11.D25(EIM_DATA23_/_IPU1_DI0_D0_CS_/_UART3_CTS_B_/_UART1_DCD_B_/_IPU2_CSI1_DATA_EN_/_<GPIO3_IO23>_/_IPU1_DI1_PIN02_/_IPU1_DI1_PIN14) ; port UART1.UART1_DCD
UART1_DSR: U11.G22(EIM_DATA25_/_ECSPI4_SS3_/_UART3_RX_DATA_/_ECSPI1_SS3_/_ECSPI2_SS3_/_<GPIO3_IO25>_/_AUD5_RXC_/_UART1_DSR_B) ; port UART1.UART1_DSR
UART1_DTR: U11.F22(EIM_DATA24_/_ECSPI4_SS2_/_UART3_TX_DATA_/_ECSPI1_SS2_/_ECSPI2_SS2_/_<GPIO3_IO24>_/_AUD5_RXFS_/_UART1_DTR_B) ; port UART1.UART1_DTR
UART1_RI: U11.F23(EIM_EB3_/_ECSPI4_RDY_/_UART3_RTS_B_/_UART1_RI_B_/_IPU2_CSI1_HSYNC_/_<GPIO2_IO31>_/_IPU1_DI1_PIN03_/_SRC_BOOT_CFG31) ; port UART1.UART1_RI
UART1_RTS: U11.G20(EIM_DATA20_/_ECSPI4_SS0_/_IPU1_DI0_PIN16_/_IPU2_CSI1_DATA15_/_UART1_RTS_B_/_<GPIO3_IO20>_/_EPIT2_OUT) ; port UART1.UART1_RTS
UART1_RXD: U11.M3(IPU1_CSI0_DATA11_/_AUD3_RXFS_/_ECSPI2_SS0_/_UART1_RX_DATA_/_<GPIO5_IO29>_/_ARM_TRACE08) ; port UART1.UART1_RXD
UART1_TXD: U11.M1(IPU1_CSI0_DATA10_/_AUD3_RXC_/_ECSPI2_MISO_/_UART1_TX_DATA_/_<GPIO5_IO28>_/_ARM_TRACE07) ; port UART1.UART1_TXD
UART2_CTS: U11.B20(SD4_DATA6_/_UART2_CTS_B_/_<GPIO2_IO14>) ; port UART2.UART2_CTS
UART2_RTS: U11.C19(SD4_DATA5_/_UART2_RTS_B_/_<GPIO2_IO13>) ; port UART2.UART2_RTS
UART2_RXD: U11.E18(SD4_DATA4_/_UART2_RX_DATA_/_<GPIO2_IO12>) ; port UART2.UART2_RXD
UART2_TXD: U11.D19(SD4_DATA7_/_UART2_TX_DATA_/_<GPIO2_IO15>) ; port UART2.UART2_TXD

### Notes on the sheet
- UART1
- UART2
- CPU UART
- DESIGN NOTES
- All UART signal should be configured in software except UART1_RXD and UART1_TXD
- Title:
- Date:
- Size A
- Project:
- Time:
- Sheet
- Revision
- of
- Engineer:
- File:
- (in symbol MCIMX6Q5EYM10AC, part M) i.MX6Q - UART; NVCC_UART1; NVCC_UART2

### Library data of the parts
U11 = MCIMX6Q5EYM10AC: as U11 on sheet EDU_High-Speed-Design_CPU_Unused; Supplier 1: Digi-Key; Manufacturer Part Number 1: MCIMX6Q5EYM10AC; Supplier Part Number 1: MCIMX6Q5EYM10AC-ND